# EAGLE board Module_BaseBoard (EAGLE 9.2.1), part 1 of 3
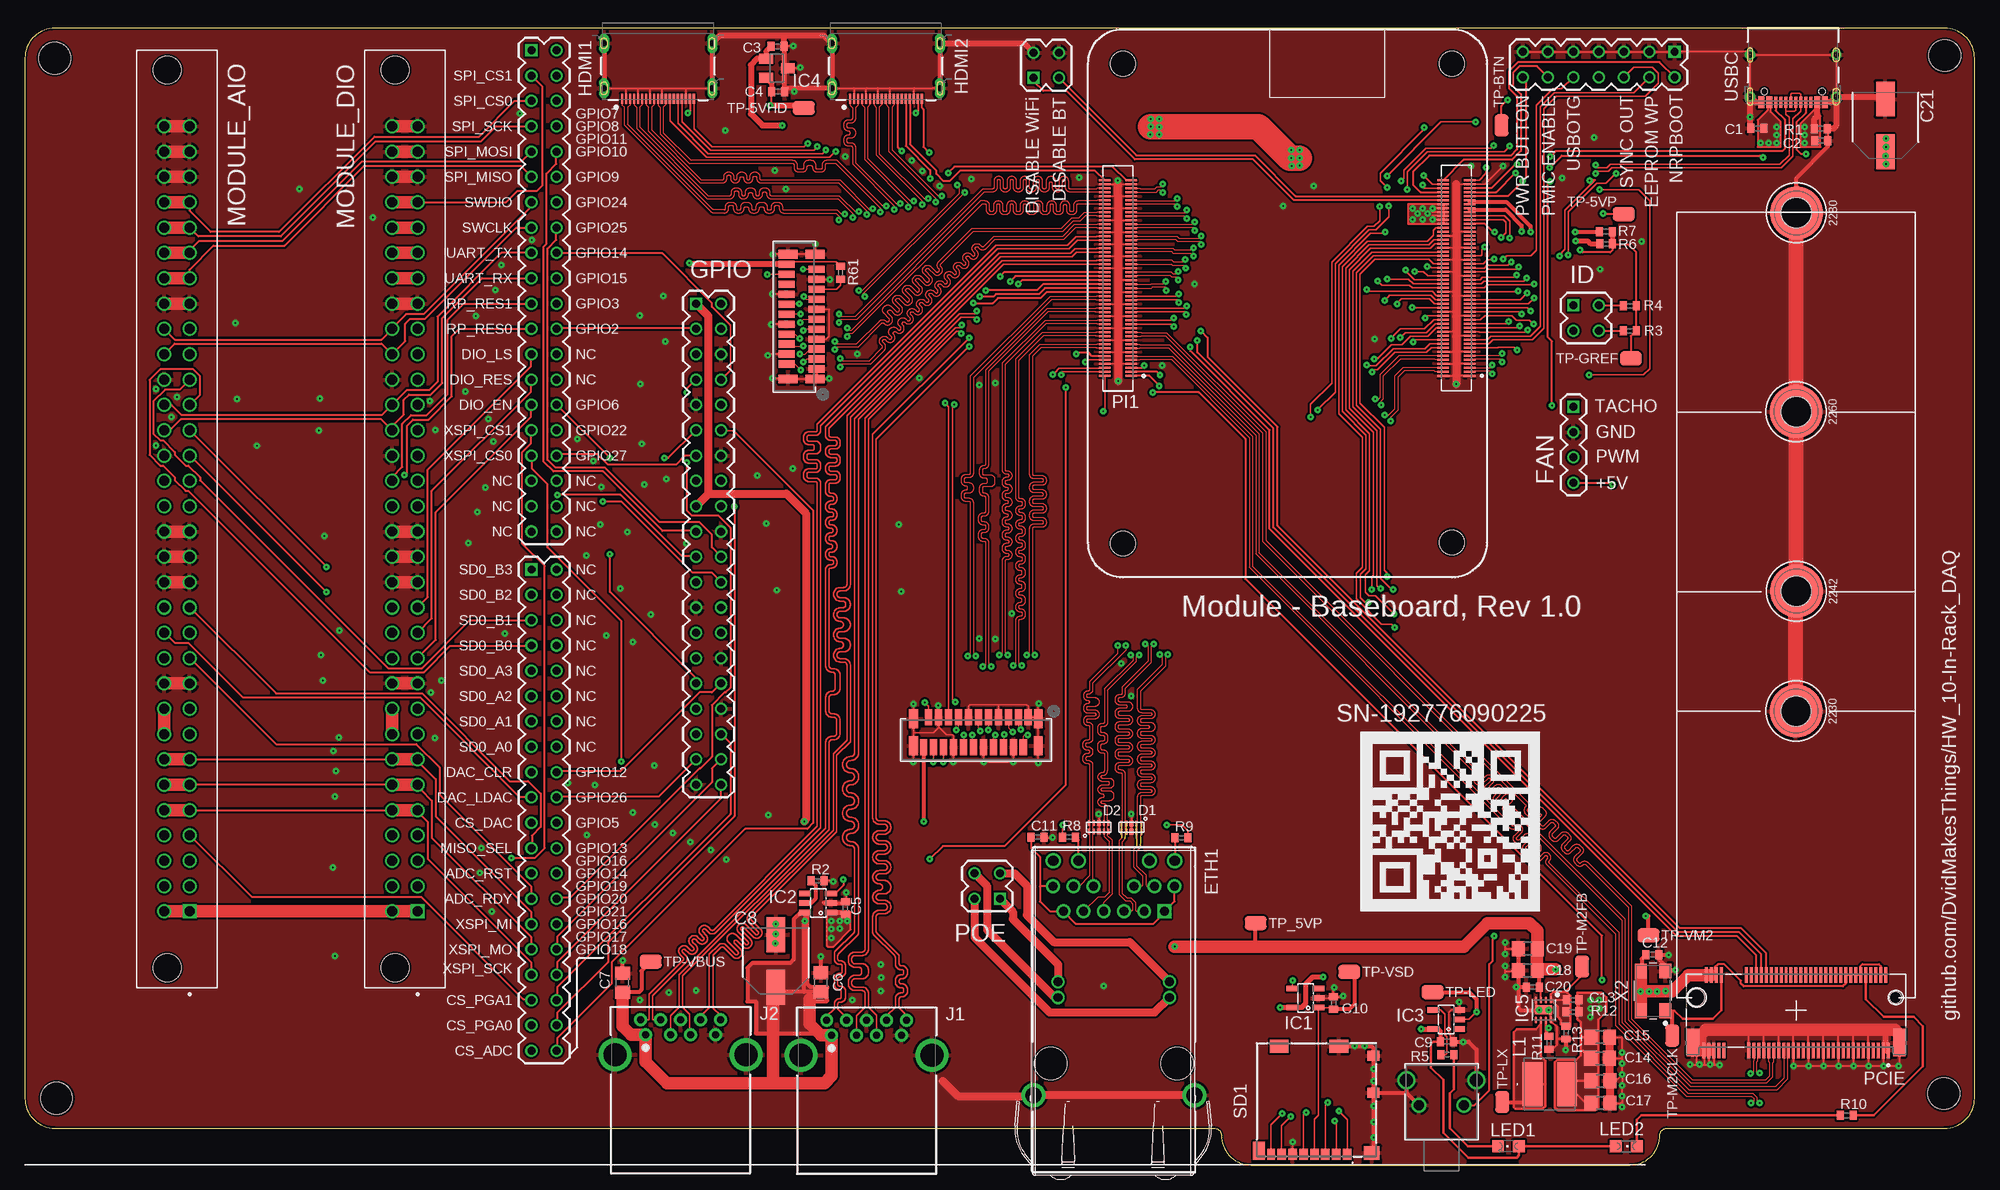
[diagram p5: board, top side]
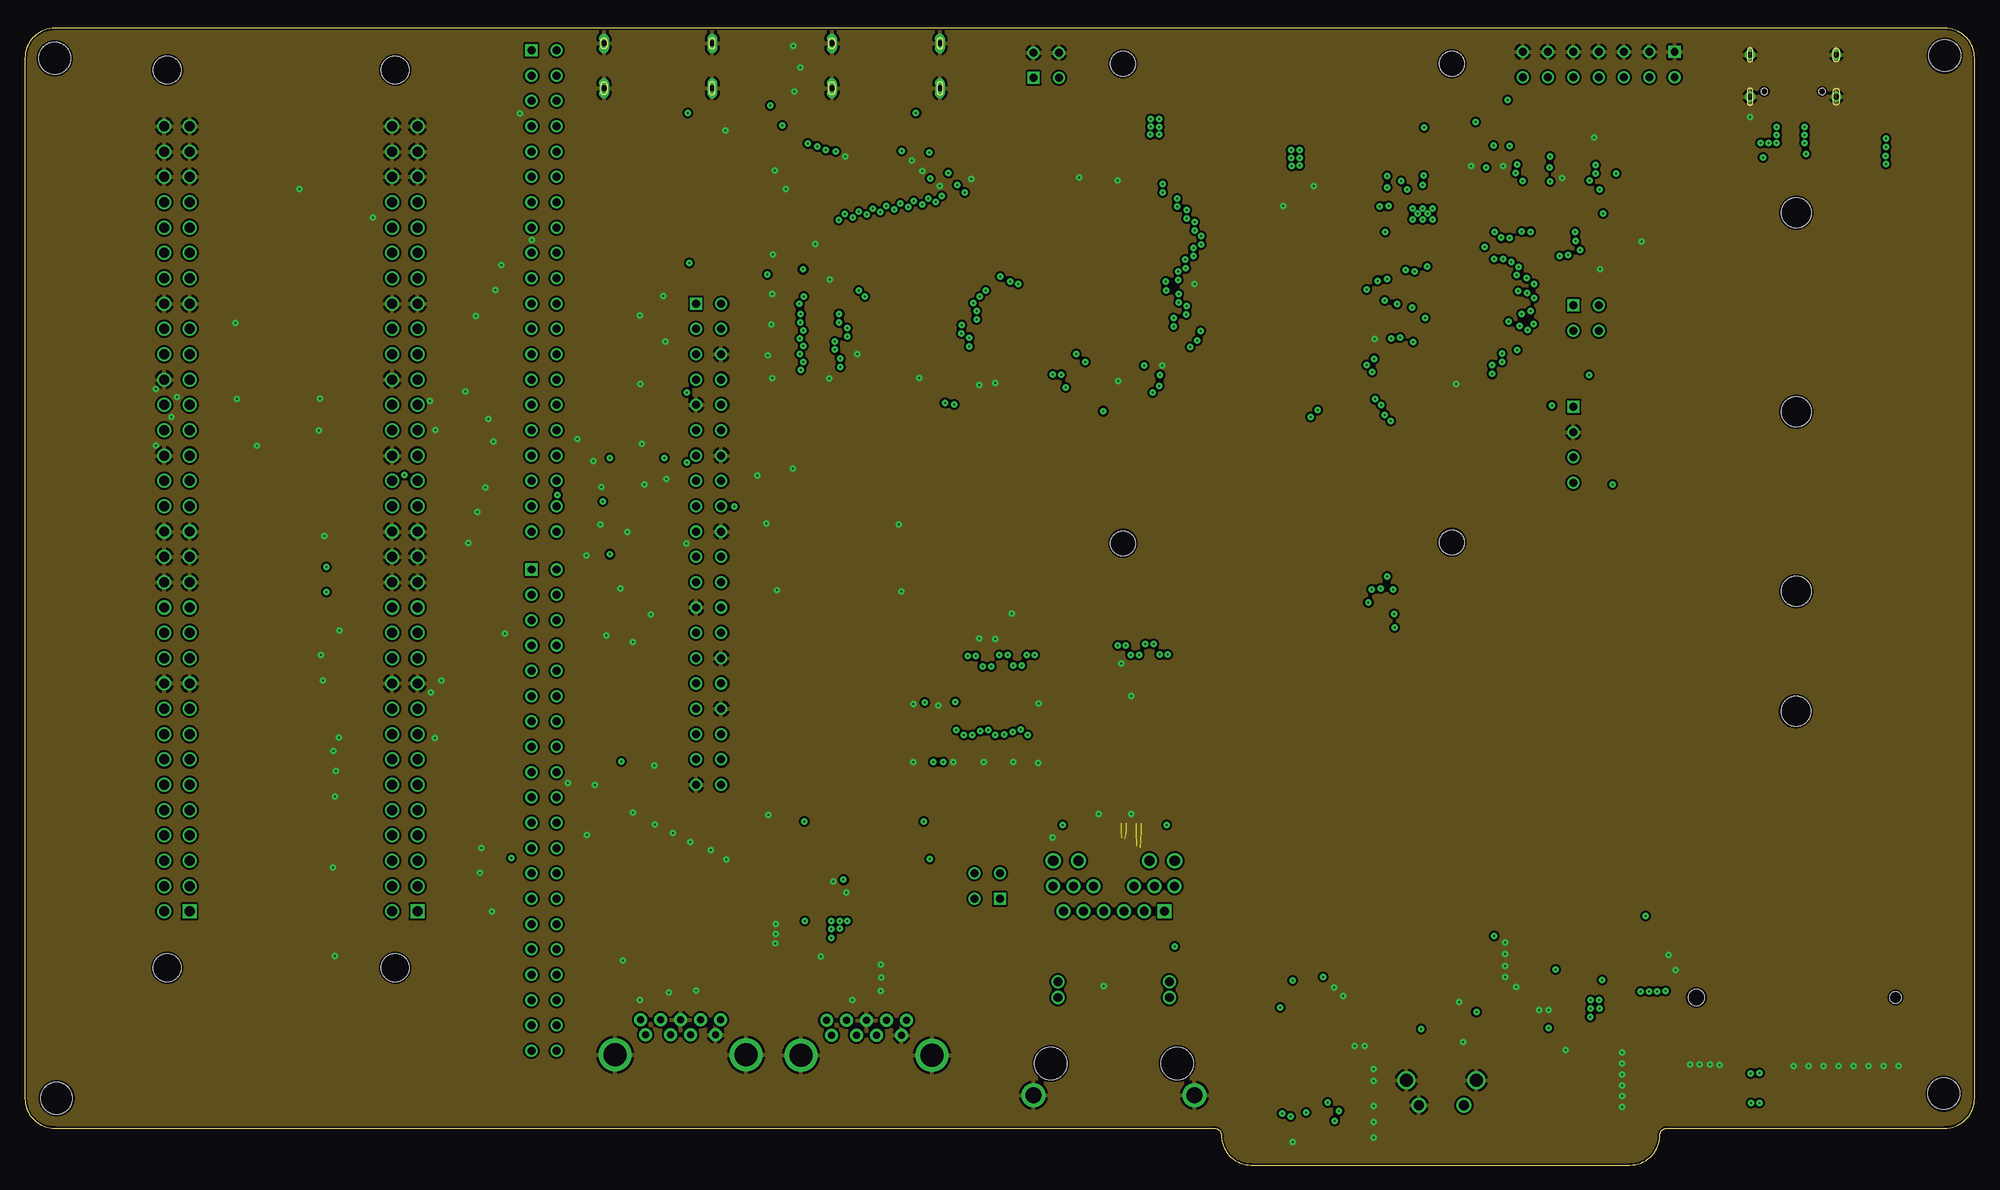
[diagram p6: board, inner layer Route2]
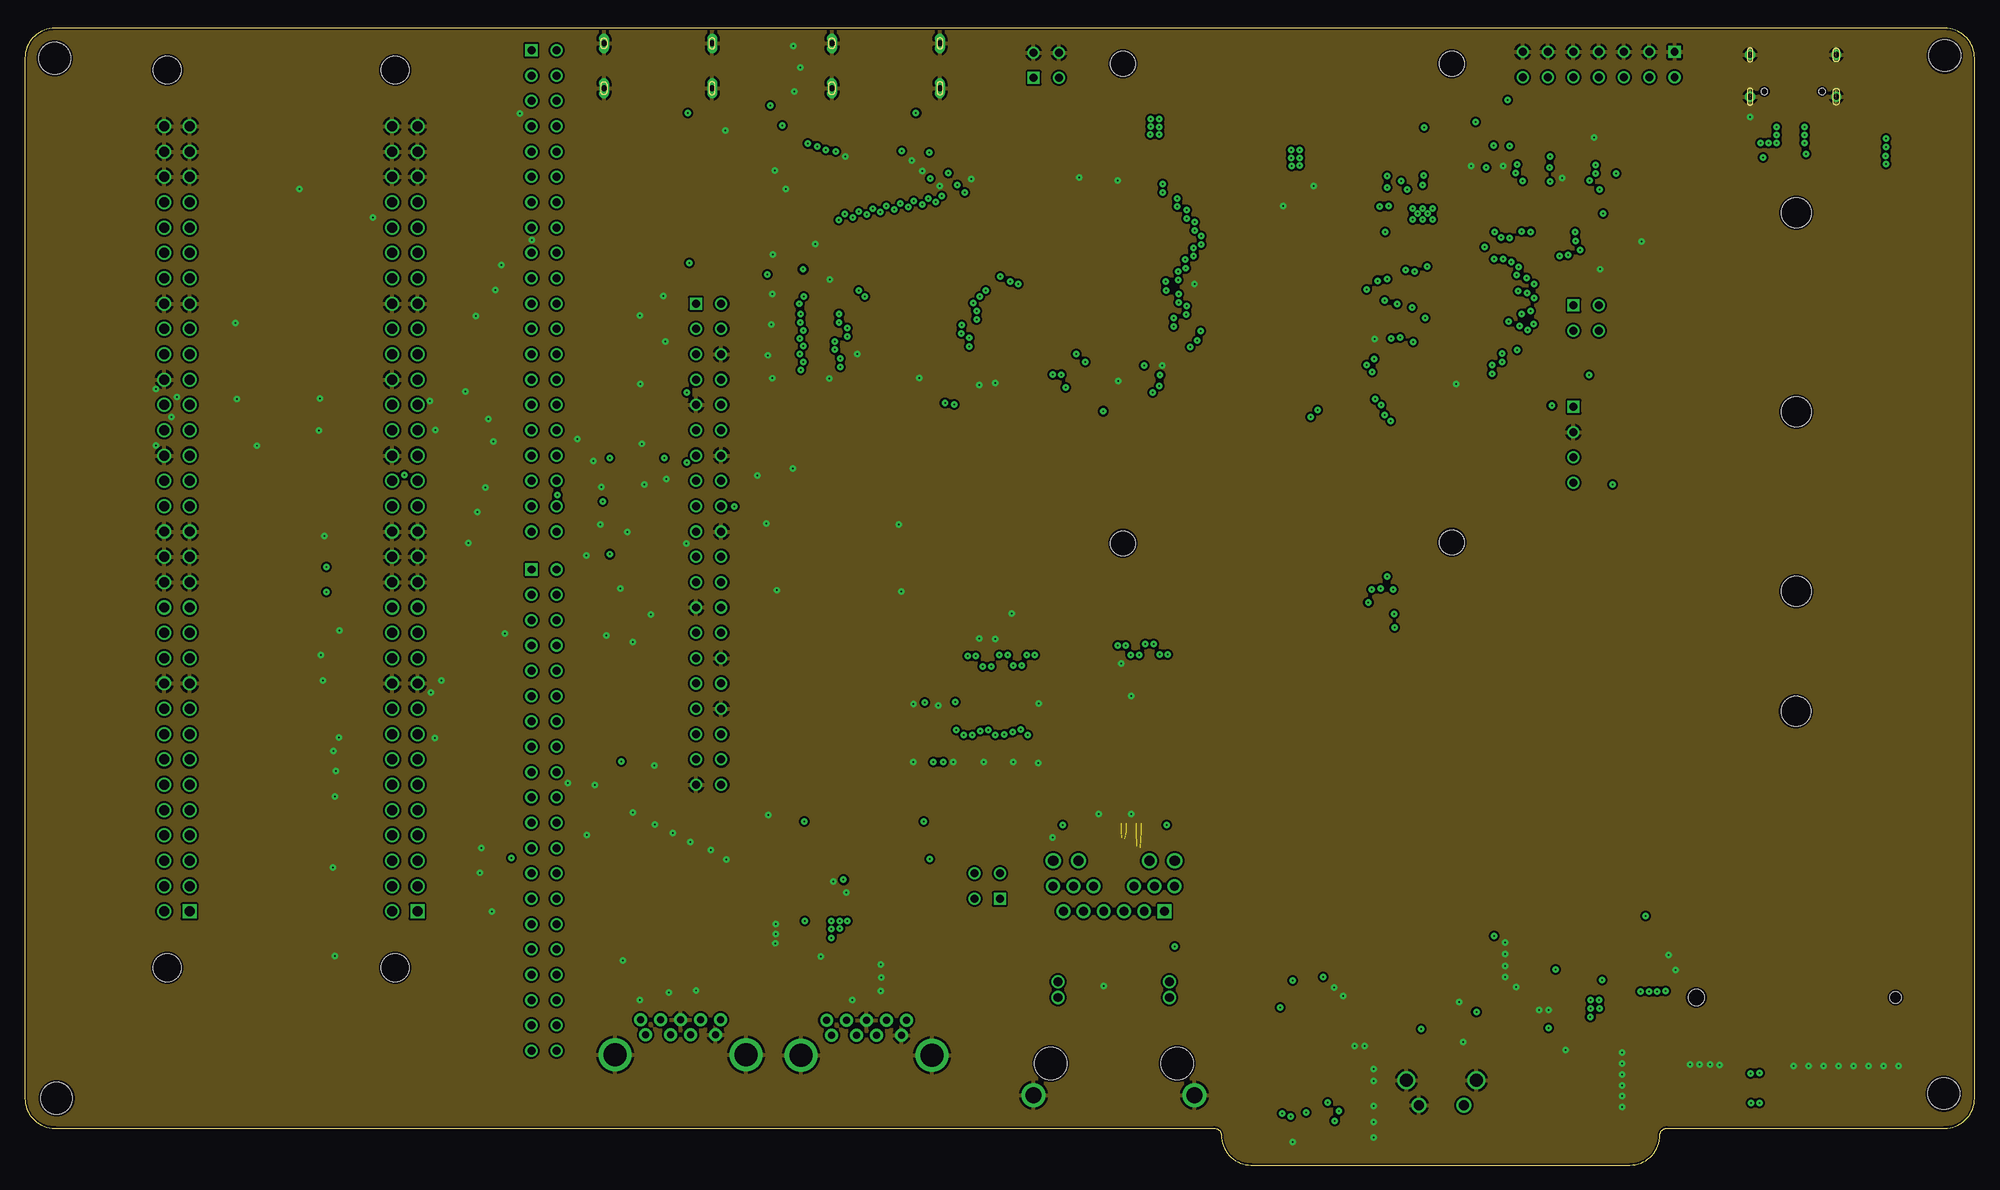
[diagram p7: board, inner layer Route15]
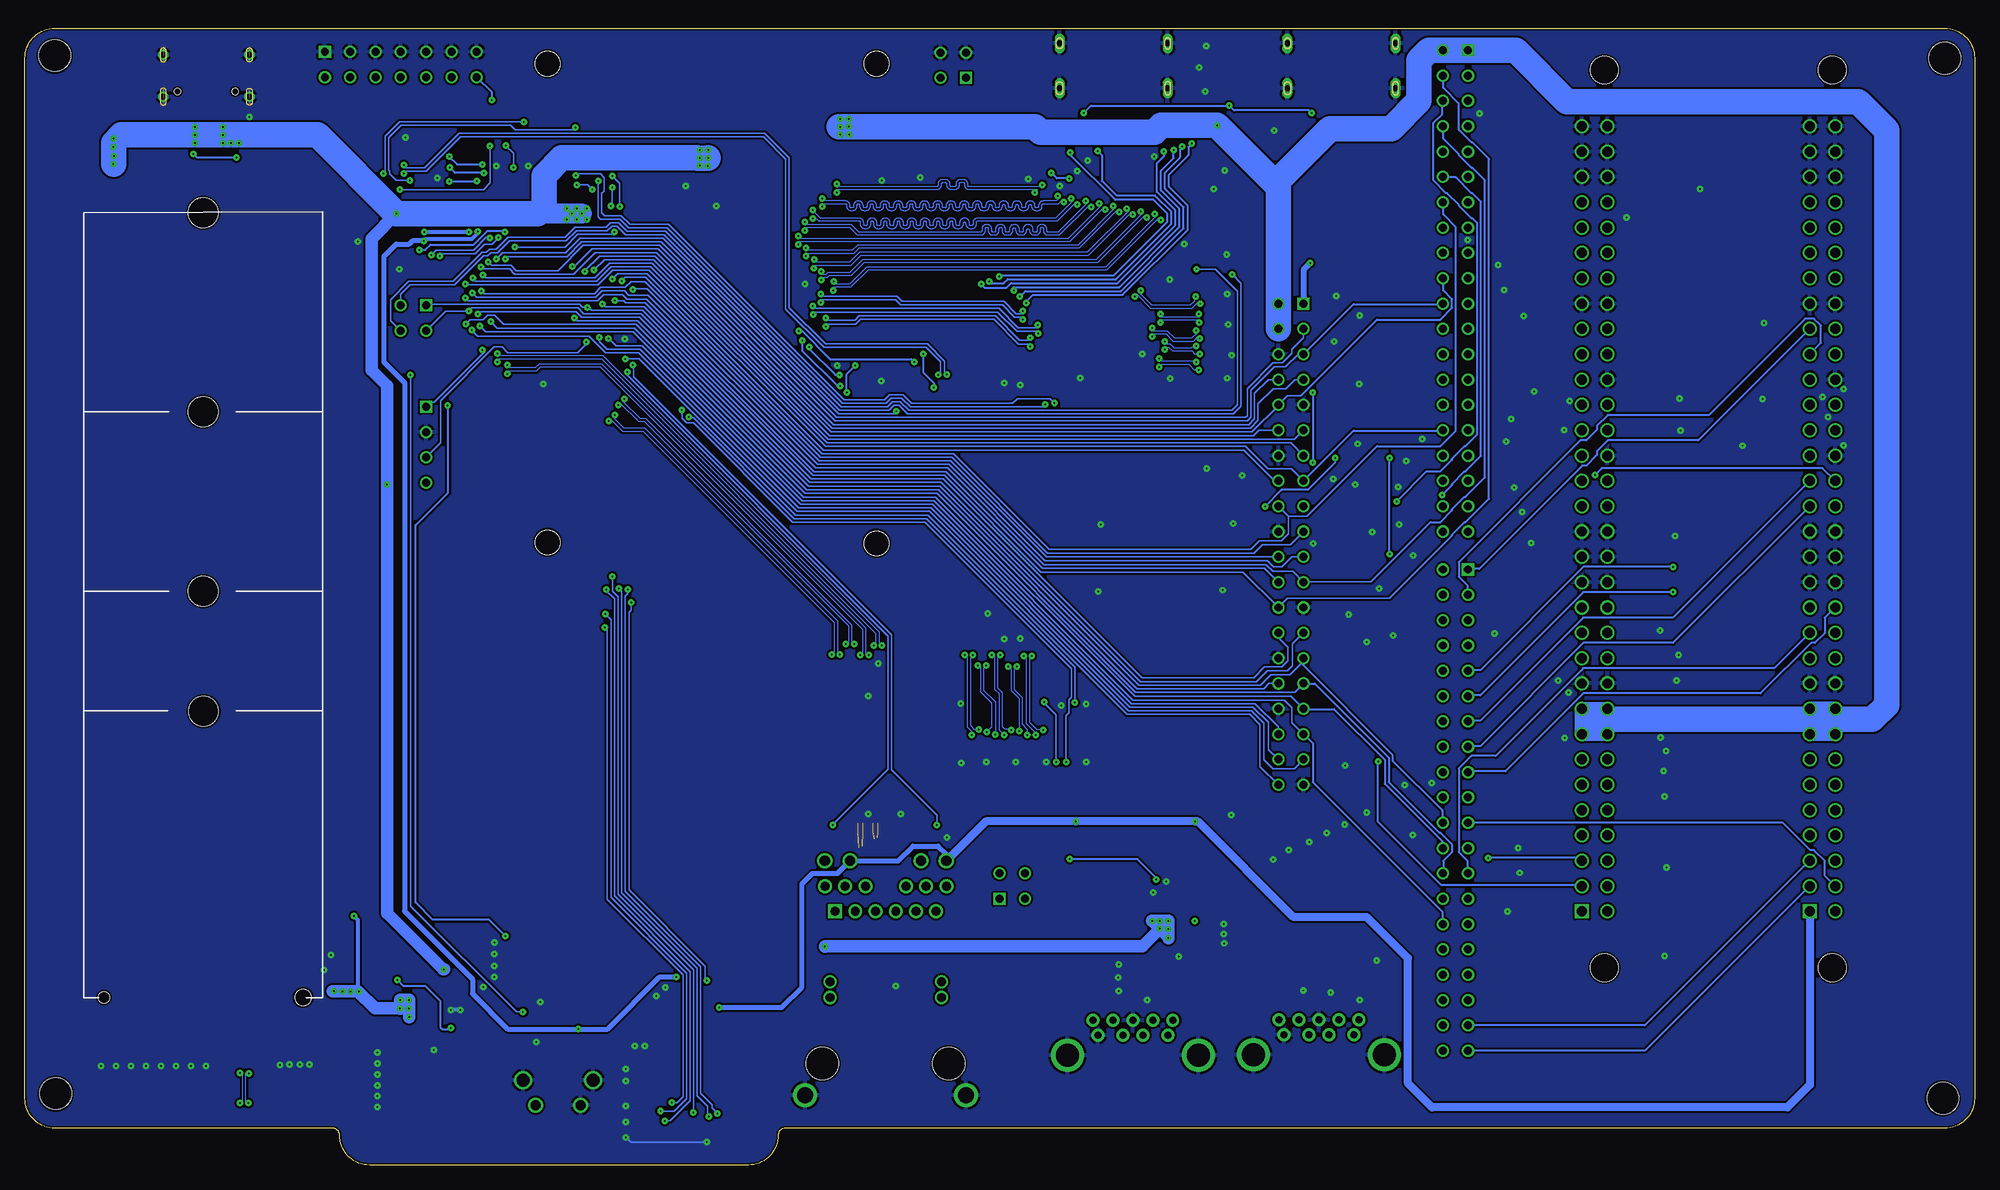
[diagram p8: board, bottom side, seen from below]

Size 195.56 x 114 mm. Coordinates in mm from the lower left corner, seen from the top.
Outline: 195.56,6.69 195.56,111 arc90 192.56,114 3,114 arc90 0,111 0,6.69 arc90 3,3.69 119.31,3.69 arc-90 120,3 arc90 123,0 161,0 arc90 164,3 arc-90 164.69,3.69 192.56,3.69 arc90 195.56,6.69
Copper layers (1+2*15+16): Top 0.035mm / dielectric 0.0994mm / Route2 0.0152mm / dielectric 1.265mm / Route15 0.0152mm / dielectric 0.0994mm / Bottom 0.035mm
Design rules "JLC04161H-3313 *": minimum track width 3.5mil, minimum drill 0.15mm, track to track 3.5mil, track to pad 3.5mil, pad to pad 3.5mil, via to via 3.5mil, smd to smd 3.5mil, copper to edge 0.2mm, drill to drill 6mil, minimum pad ring 8mil, minimum via ring 0.25mm, stop-mask expansion 0.05mm, vias tented up to drill 16mil, thermal gap 10mil
Net classes: 0 default: width 0.16 mm, drill 0.15 mm, clearance 0.191 mm; 1 50R_DIFFPAIR: width 0.4 mm, drill 0.15 mm, clearance 0.191 mm; 2 90R_DIFFPAIR: width 0.155 mm, drill 0.15 mm, clearance 0.191 mm; 3 100R_DIFFPAIR: width 0.121 mm, drill 0.15 mm, clearance 0.191 mm
Holes 3.2 mm at 3.17,6.71 3,111 192.58,111.26 192.47,7.17

## Footprints (pad centres in the part's own frame; a part is rotated, then mirrored left to right if it is on the bottom)
WA-SMSI_9774010243 = smd 5.3 x 5.3: 1 0,0 | hole 3: 0,0
C0402 = smd 0.7 x 0.9: 1 -0.65,0; 2 0.65,0
C0805 = smd 1.3 x 1.5: 1 -0.95,0; 2 0.95,0
100UF-16V = smd 3.5 x 1.85: 1 -2.65,0; 2 2.65,0
2X20 = drill 0.8 square: 1 -1.27,24.13 | drill 0.8: 2 1.27,24.13; 3 -1.27,21.59; 4 1.27,21.59; 5 -1.27,19.05; 6 1.27,19.05; 7 -1.27,16.51; 8 1.27,16.51; 9 -1.27,13.97; 10 1.27,13.97; 11 -1.27,11.43; 12 1.27,11.43; 13 -1.27,8.89; 14 1.27,8.89; 15 -1.27,6.35; 16 1.27,6.35; 17 -1.27,3.81; 18 1.27,3.81; 19 -1.27,1.27; 20 1.27,1.27; 21 -1.27,-1.27; 22 1.27,-1.27; 23 -1.27,-3.81; 24 1.27,-3.81; 25 -1.27,-6.35; 26 1.27,-6.35; 27 -1.27,-8.89; 28 1.27,-8.89; 29 -1.27,-11.43; 30 1.27,-11.43; 31 -1.27,-13.97; 32 1.27,-13.97; 33 -1.27,-16.51; 34 1.27,-16.51; 35 -1.27,-19.05; 36 1.27,-19.05; 37 -1.27,-21.59; 38 1.27,-21.59; 39 -1.27,-24.13; 40 1.27,-24.13
USON = smd 0.57 x 0.2: 1 -0.4,1; 2 -0.4,0.5; 4 -0.4,-0.5; 5 -0.4,-1; 6 0.435,-1; 7 0.435,-0.5; 9 0.435,0.5; 10 0.435,1 | smd 0.57 x 0.4: 3 -0.4,0; 8 0.435,0
MAGJACK_POE = drill 1.02 pad 1.53: 17 6.11,15.24; 18 3.57,15.24; 19 -3.54,15.24; 20 -6.08,15.24 | drill 0.9 pad 1.4: CT1 -6.08,12.7; CT2 -5.07,10.16; CT4 6.1,12.7; TD1+ -4.05,12.7; TD1- -2.02,12.7; TD2+ -1.01,10.16; TD2- -3.04,10.16; TD3+ 1.02,10.16; TD3- 3.05,10.16; TD4+ 4.07,12.7; TD4- 2.04,12.7 | drill 0.9 pad 1.4 square: CT3 5.08,10.16 | drill 1.6 pad 2.4: MH3 -8.06,-8.25; MH4 8.08,-8.25 | drill 0.9 pad 1.25: VC1 5.6,3.1; VC2 -5.58,3.1; VC3 5.6,1.53; VC4 -5.58,1.53 | hole 3.25: -6.34,-5.08; 6.36,-5.08
1X4 = drill 0.8 square: 1 0,3.81 | drill 0.8: 2 0,1.27; 3 0,-1.27; 4 0,-3.81
685119136923 = smd 0.23 x 1: 1 3.6,1.05; 2 3.2,1.05; 3 2.8,1.05; 4 2.4,1.05; 5 2,1.05; 6 1.6,1.05; 7 1.2,1.05; 8 0.8,1.05; 9 0.4,1.05; 10 0,1.05; 11 -0.4,1.05; 12 -0.8,1.05; 13 -1.2,1.05; 14 -1.6,1.05; 15 -2,1.05; 16 -2.4,1.05; 17 -2.8,1.05; 18 -3.2,1.05; 19 -3.6,1.05 | drill 0.6 pad 0.9 long: S1 5.425,0; S2 -5.425,0 | drill 0.6 pad 0.8 long: S3 -5.425,-4.5; S4 5.425,-4.5
SOT23-5 = smd 0.55 x 1.2: 1 -0.95,-1.3; 2 0,-1.3; 3 0.95,-1.3; 4 0.95,1.3; 5 -0.95,1.3
SOT23-6 = smd 0.55 x 1.2: 1 -0.95,-1.3; 2 0,-1.3; 3 0.95,-1.3; 4 0.95,1.3; 5 0,1.3; 6 -0.95,1.3
SOT23 = smd 1 x 1.4: 1 -0.95,-1.1; 2 0.95,-1.1; 3 0,1.1
SON50P201X201X56-9T90X170N = smd 0.715 x 0.27: 1 -1.001,0.75; 2 -1.001,0.25; 3 -1.001,-0.25; 4 -1.001,-0.75; 5 1.001,-0.75; 6 1.001,-0.25; 7 1.001,0.25; 8 1.001,0.75 | smd 0.9 x 1.7: 9 0,0
2X2 = drill 0.8 square: 1 -1.27,1.27 | drill 0.8: 2 1.27,1.27; 3 -1.27,-1.27; 4 1.27,-1.27
692121030100 = drill 0.7 pad 1.3: 1 -3.5,5.36; 2 -1,5.36; 3 1,5.36; 4 3.5,5.36; 5 4,6.86; 6 2,6.86; 7 0,6.86; 8 -2,6.86; 9 -4,6.86 | drill 2.3 pad 3.3: S1 -6.57,3.36; S2 6.57,3.36
FH12-22S-0.5SH = smd 0.711 x 1.6: 1 5.251,2.244; 2 4.751,-0.756; 3 4.251,2.244; 4 3.751,-0.756; 5 3.251,2.244; 6 2.751,-0.756; 7 2.251,2.244; 8 1.75,-0.756; 9 1.25,2.244; 10 0.75,-0.756; 11 0.25,2.244; 12 -0.25,-0.756; 13 -0.75,2.244; 14 -1.25,-0.756; 15 -1.75,2.244; 16 -2.251,-0.756; 17 -2.751,2.244; 18 -3.251,-0.756; 19 -3.751,2.244; 20 -4.251,-0.756; 21 -4.751,2.244; 22 -5.251,-0.756 | smd 0.889 x 1.905: 23 -6.25,2.091; 24 6.25,2.091; 25 -6.25,-0.604; 26 6.25,-0.604
2X7 = drill 0.8 square: 1 -1.27,7.62 | drill 0.8: 2 1.27,7.62; 3 -1.27,5.08; 4 1.27,5.08; 5 -1.27,2.54; 6 1.27,2.54; 7 -1.27,0; 8 1.27,0; 9 -1.27,-2.54; 10 1.27,-2.54; 11 -1.27,-5.08; 12 1.27,-5.08; 13 -1.27,-7.62; 14 1.27,-7.62
SRR5228A = smd 4.4 x 2: 1 0,1.75; 2 0,-1.75
CHIPLED_0805 = smd 1.2 x 1.2: A 0,-1.05; C 0,1.05
CON-VG-MAB64-RECEPTACLE = drill 1 pad 1.35 square: A1 39.37,1.27 | drill 1 pad 1.35: A2 36.83,1.27; A3 34.29,1.27; A4 31.75,1.27; A5 29.21,1.27; A6 26.67,1.27; A7 24.13,1.27; A8 21.59,1.27; A9 19.05,1.27; A10 16.51,1.27; A11 13.97,1.27; A12 11.43,1.27; A13 8.89,1.27; A14 6.35,1.27; A15 3.81,1.27; A16 1.27,1.27; A17 -1.27,1.27; A18 -3.81,1.27; A19 -6.35,1.27; A20 -8.89,1.27; A21 -11.43,1.27; A22 -13.97,1.27; A23 -16.51,1.27; A24 -19.05,1.27; A25 -21.59,1.27; A26 -24.13,1.27; A27 -26.67,1.27; A28 -29.21,1.27; A29 -31.75,1.27; A30 -34.29,1.27; A31 -36.83,1.27; A32 -39.37,1.27; B1 39.37,-1.27; B2 36.83,-1.27; B3 34.29,-1.27; B4 31.75,-1.27; B5 29.21,-1.27; B6 26.67,-1.27; B7 24.13,-1.27; B8 21.59,-1.27; B9 19.05,-1.27; B10 16.51,-1.27; B11 13.97,-1.27; B12 11.43,-1.27; B13 8.89,-1.27; B14 6.35,-1.27; B15 3.81,-1.27; B16 1.27,-1.27; B17 -1.27,-1.27; B18 -3.81,-1.27; B19 -6.35,-1.27; B20 -8.89,-1.27; B21 -11.43,-1.27; B22 -13.97,-1.27; B23 -16.51,-1.27; B24 -19.05,-1.27; B25 -21.59,-1.27; B26 -24.13,-1.27; B27 -26.67,-1.27; B28 -29.21,-1.27; B29 -31.75,-1.27; B30 -34.29,-1.27; B31 -36.83,-1.27; B32 -39.37,-1.27 | hole 2.79: -45.01,-0.97; 45.01,-0.97
M.2 = smd 0.3 x 1.55: 1 9.25,-4.005; 2 9,3.545; 3 8.75,-4.005; 4 8.5,3.545; 5 8.25,-4.005; 6 8,3.545; 7 7.75,-4.005; 8 7.5,3.545; 9 7.25,-4.005; 10 7,3.545; 11 6.75,-4.005; 12 6.5,3.545; 13 6.25,-4.005; 14 6,3.545; 15 5.75,-4.005; 16 5.5,3.545; 17 5.25,-4.005; 18 5,3.545; 19 4.75,-4.005; 20 4.5,3.545; 21 4.25,-4.005; 22 4,3.545; 23 3.75,-4.005; 24 3.5,3.545; 25 3.25,-4.005; 26 3,3.545; 27 2.75,-4.005; 28 2.5,3.545; 29 2.25,-4.005; 30 2,3.545; 31 1.75,-4.005; 32 1.5,3.545; 33 1.25,-4.005; 34 1,3.545; 35 0.75,-4.005; 36 0.5,3.545; 37 0.25,-4.005; 38 0,3.545; 39 -0.25,-4.005; 40 -0.5,3.545; 41 -0.75,-4.005; 42 -1,3.545; 43 -1.25,-4.005; 44 -1.5,3.545; 45 -1.75,-4.005; 46 -2,3.545; 47 -2.25,-4.005; 48 -2.5,3.545; 49 -2.75,-4.005; 50 -3,3.545; 51 -3.25,-4.005; 52 -3.5,3.545; 53 -3.75,-4.005; 54 -4,3.545; 55 -4.25,-4.005; 56 -4.5,3.545; 57 -4.75,-4.005; 58 -5,3.545; 67 -7.25,-4.005; 68 -7.5,3.545; 69 -7.75,-4.005; 70 -8,3.545; 71 -8.25,-4.005; 72 -8.5,3.545; 73 -8.75,-4.005; 74 -9,3.545; 75 -9.25,-4.005 | smd 1.2 x 2.75: S1 10.35,-3.23; S2 -10.35,-3.23 | hole 1.15: 10,1.27 | hole 1.65: -10,1.27
CM5 = smd 1.14 x 0.2: 1 17.9,-7.22; 2 15.26,-7.22; 3 17.9,-6.82; 4 15.26,-6.82; 5 17.9,-6.42; 6 15.26,-6.42; 7 17.9,-6.02; 8 15.26,-6.02; 9 17.9,-5.62; 10 15.26,-5.62; 11 17.9,-5.22; 12 15.26,-5.22; 13 17.9,-4.82; 14 15.26,-4.82; 15 17.9,-4.42; 16 15.26,-4.42; 17 17.9,-4.02; 18 15.26,-4.02; 19 17.9,-3.62; 20 15.26,-3.62; 21 17.9,-3.22; 22 15.26,-3.22; 23 17.9,-2.82; 24 15.26,-2.82; 25 17.9,-2.42; 26 15.26,-2.42; 27 17.9,-2.02; 28 15.26,-2.02; 29 17.9,-1.62; 30 15.26,-1.62; 31 17.9,-1.22; 32 15.26,-1.22; 33 17.9,-0.82; 34 15.26,-0.82; 35 17.9,-0.42; 36 15.26,-0.42; 37 17.9,-0.02; 38 15.26,-0.02; 39 17.9,0.38; 40 15.26,0.38; 41 17.9,0.78; 42 15.26,0.78; 43 17.9,1.18; 44 15.26,1.18; 45 17.9,1.58; 46 15.26,1.58; 47 17.9,1.98; 48 15.26,1.98; 49 17.9,2.38; 50 15.26,2.38; 51 17.9,2.78; 52 15.26,2.78; 53 17.9,3.18; 54 15.26,3.18; 55 17.9,3.58; 56 15.26,3.58; 57 17.9,3.98; 58 15.26,3.98; 59 17.9,4.38; 60 15.26,4.38; 61 17.9,4.78; 62 15.26,4.78; 63 17.9,5.18; 64 15.26,5.18; 65 17.9,5.58; 66 15.26,5.58; 67 17.9,5.98; 68 15.26,5.98; 69 17.9,6.38; 70 15.26,6.38; 71 17.9,6.78; 72 15.26,6.78; 73 17.9,7.18; 74 15.26,7.18; 75 17.9,7.58; 76 15.26,7.58; 77 17.9,7.98; 78 15.26,7.98; 79 17.9,8.38; 80 15.26,8.38; 81 17.9,8.78; 82 15.26,8.78; 83 17.9,9.18; 84 15.26,9.18; 85 17.9,9.58; 86 15.26,9.58; 87 17.9,9.98; 88 15.26,9.98; 89 17.9,10.38; 90 15.26,10.38; 91 17.9,10.78; 92 15.26,10.78; 93 17.9,11.18; 94 15.26,11.18; 95 17.9,11.58; 96 15.26,11.58; 97 17.9,11.98; 98 15.26,11.98; 99 17.9,12.38; 100 15.26,12.38; 101 -16.041,-7.26; 102 -18.681,-7.26; 103 -16.041,-6.86; 104 -18.681,-6.86; 105 -16.041,-6.46; 106 -18.681,-6.46; 107 -16.041,-6.06; 108 -18.681,-6.06; 109 -16.041,-5.66; 110 -18.681,-5.66; 111 -16.041,-5.26; 112 -18.681,-5.26; 113 -16.041,-4.86; 114 -18.681,-4.86; 115 -16.041,-4.46; 116 -18.681,-4.46; 117 -16.041,-4.06; 118 -18.681,-4.06; 119 -16.041,-3.66; 120 -18.681,-3.66; 121 -16.041,-3.26; 122 -18.681,-3.26; 123 -16.041,-2.86; 124 -18.681,-2.86; 125 -16.041,-2.46; 126 -18.681,-2.46; 127 -16.041,-2.06; 128 -18.681,-2.06; 129 -16.041,-1.66; 130 -18.681,-1.66; 131 -16.041,-1.26; 132 -18.681,-1.26; 133 -16.041,-0.86; 134 -18.681,-0.86; 135 -16.041,-0.46; 136 -18.681,-0.46; 137 -16.041,-0.06; 138 -18.681,-0.06; 139 -16.041,0.34; 140 -18.681,0.34; 141 -16.041,0.74; 142 -18.681,0.74; 143 -16.041,1.14; 144 -18.681,1.14; 145 -16.041,1.54; 146 -18.681,1.54; 147 -16.041,1.94; 148 -18.681,1.94; 149 -16.041,2.34; 150 -18.681,2.34; 151 -16.041,2.74; 152 -18.681,2.74; 153 -16.041,3.14; 154 -18.681,3.14; 155 -16.041,3.54; 156 -18.681,3.54; 157 -16.041,3.94; 158 -18.681,3.94; 159 -16.041,4.34; 160 -18.681,4.34; 161 -16.041,4.74; 162 -18.681,4.74; 163 -16.041,5.14; 164 -18.681,5.14; 165 -16.041,5.54; 166 -18.681,5.54; 167 -16.041,5.94; 168 -18.681,5.94; 169 -16.041,6.34; 170 -18.681,6.34; 171 -16.041,6.74; 172 -18.681,6.74; 173 -16.041,7.14; 174 -18.681,7.14; 175 -16.041,7.54; 176 -18.681,7.54; 177 -16.041,7.94; 178 -18.681,7.94; 179 -16.041,8.34; 180 -18.681,8.34; 181 -16.041,8.74; 182 -18.681,8.74; 183 -16.041,9.14; 184 -18.681,9.14; 185 -16.041,9.54; 186 -18.681,9.54; 187 -16.041,9.94; 188 -18.681,9.94; 189 -16.041,10.34; 190 -18.681,10.34; 191 -16.041,10.74; 192 -18.681,10.74; 193 -16.041,11.14; 194 -18.681,11.14; 195 -16.041,11.54; 196 -18.681,11.54; 197 -16.041,11.94; 198 -18.681,11.94; 199 -16.041,12.34; 200 -18.681,12.34 | hole 2.5: -16.86,24.04; 16.14,24.04; -16.86,-24.06; 16.14,-23.96
0402 = smd 0.7 x 0.9: 1 -0.65,0; 2 0.65,0
MICROSD = smd 0.85 x 1.1: CLK -1.295,-5.294; CMD 0.905,-5.294; DAT0 -3.495,-5.294; DAT2 3.105,-5.294; DAT3/CD 2.005,-5.294; VDD -0.195,-5.294; VSS -2.395,-5.294 | smd 0.75 x 1.1: DAT1 -4.545,-5.294 | smd 1.17 x 1.8: DET1 -5.755,-4.944 | smd 1.9 x 1.35: DET2 -3.73,5.531; MT1 2.24,5.531 | smd 1.2 x 1: MT2 5.74,4.556; MT3 5.74,0.856 | smd 1.55 x 1.35: MT4 5.565,-5.169
SW2_1825027-C_TEC = drill 0.991 pad 1.499: 1 0,0; 2 4.496,0 | drill 1.295 pad 1.803: 3 -1.245,2.489; 4 5.766,2.489
TP = smd 2.2 x 1.4: TP 0,0
629722000214 = smd 0.3 x 1.15: A1 -3.35,4.745; A4 -2.55,4.745; A5 -1.25,4.745; A6 -0.25,4.745; A7 0.25,4.745; A8 1.25,4.745; A9 2.55,4.745; A12 3.35,4.745; B1 3.05,4.745; B4 2.25,4.745; B5 1.75,4.745; B6 0.75,4.745; B7 -0.75,4.745; B8 -1.75,4.745; B9 -2.25,4.745; B12 -3.05,4.745 | drill 0.6 pad 1: S1 -4.32,4.18; S2 4.32,4.18; S3 -4.32,0; S4 4.32,0 | hole 0.65: -2.89,3.68; 2.89,3.68
OSCCC500X320X130 = smd 1.487 x 1.187: 1 -1.988,-1.238; 2 1.988,-1.238; 3 1.988,1.238; 4 -1.988,1.238

## Placement (x,y rotation side)
2230  M2 x 1mm  [WA-SMSI_9774010243]  177.65,45.52 270 top
2242  M2 x 1mm  [WA-SMSI_9774010243]  177.69,57.56 270 top
2260  M2 x 1mm  [WA-SMSI_9774010243]  177.66,75.55 270 top
2280  M2 x 1mm  [WA-SMSI_9774010243]  177.69,95.48 270 top
C1  [C0402]  173.78,103.96 180 top
C2  [C0402]  180.17,102.73 0 top
C3  100nF  [C0402]  75.48,112.18 0 top
C4  100nF  [C0402]  75.55,107.65 0 top
C5  100nF  [C0402]  82.31,25.75 90 top
C6  10uF  [C0805]  79.83,18.32 90 top
C7  10uF  [C0805]  59.94,18.3 90 top
C8  100uF 16V  [100UF-16V]  75.33,20.46 90 top
C9  100nF  [C0402]  142.63,12.37 0 top
C10  100nF  [C0402]  131.27,16.25 90 top
C11  100nF  [C0402]  101.57,32.89 0 top
C12  100nF  [C0402]  163.24,21.09 0 top
C13  4.7nF  [C0402]  155.24,16.57 180 top
C14  10uF  [C0805]  157.99,10.69 0 top
C15  10uF  [C0805]  158,12.83 0 top
C16  10uF  [C0805]  158.01,8.44 0 top
C17  10uF  [C0805]  158.02,6.22 0 top
C18  10uF  [C0805]  150.73,19.51 180 top
C19  10uF  [C0805]  150.74,21.7 180 top
C20  100nF  [C0402]  151.24,17.85 180 top
C21  100uF 16V  [100UF-16V]  186.62,104.25 90 top
CON2  [2X20]  52.07,35.59 0 top
CON3  [2X20]  52.07,87.66 0 top
D1  TPD4EUSB30  [USON]  110.99,33.86 270 top
D2  TPD4EUSB30  [USON]  107.71,33.86 90 top
ETH1  G16LX-188S7-1G-GO-Y  [MAGJACK_POE]  109.22,15.27 0 top
FAN  [1X4]  155.33,72.23 0 top
GPIO  [2X20]  68.58,62.26 0 top
HDMI1  685119136923  [685119136923]  63.5,107.98 180 top
HDMI2  685119136923  [685119136923]  86.36,107.98 180 top
IC1  RT9742GGJ  [SOT23-5]  128.46,16.74 90 top
IC2  AP22653W6  [SOT23-6]  79.57,26.27 90 top
IC3  74LVC1G07  [SOT23-5]  142.56,14.61 90 top
IC4  RT9742NGV  [SOT23]  75.42,109.99 270 top
IC5  AP3441SHE-7B  [SON50P201X201X56-9T90X170N]  152.33,15.55 270 top
ID  [2X2]  156.6,84.93 0 top
J1  692121030100  [692121030100]  84.43,7.64 0 top
J2  692121030100  [692121030100]  65.77,7.7 0 top
J3  FH12-22S-0.5SVA  [FH12-22S-0.5SH]  95.39,42.64 0 top
J4  FH12-22S-0.5SVA  [FH12-22S-0.5SH]  77.17,85.08 270 top
JP2  [2X7]  157.85,110.36 270 top
JP3  [2X2]  102.44,110.29 90 top
L1  L  [SRR5228A]  152.94,8.12 90 top
LED1  Green  [CHIPLED_0805]  148.82,1.89 90 top
LED2  [CHIPLED_0805]  160.62,1.88 270 top
MODULE_AIO  CON-VG_MAB642  [CON-VG-MAB64-RECEPTACLE]  15.24,64.8 270 top
MODULE_DIO  CON-VG_MAB642  [CON-VG-MAB64-RECEPTACLE]  38.1,64.8 270 top
PCIE  M.2  [M.2]  177.65,15.51 0 top
PI1  [CM5]  127,86.39 0 top
POE  POE  [2X2]  96.52,27.97 180 top
R1  2.2K 1%  [0402]  180.15,103.94 0 top
R2  15K 1%  [0402]  79.52,28.51 0 top
R3  2.2K 1%  [0402]  160.96,83.65 180 top
R4  2.2K 1%  [0402]  160.97,86.15 180 top
R5  1K  [0402]  142.66,11.07 180 top
R6  0R  [0402]  158.6,92.37 0 top
R7  DNI  [0402]  158.59,93.61 0 top
R8  470R  [0402]  104.71,32.89 0 top
R9  470R  [0402]  115.99,32.82 0 top
R10  [0402]  182.73,4.97 0 top
R11  100K 1%  [0402]  152.86,12.28 270 top
R12  10K 1%  [0402]  155.23,15.36 180 top
R13  2.2K 1%  [0402]  154.57,13.29 270 top
R61  2.2K 1%  [0402]  81.81,89.46 90 top
SD1  [MICROSD]  129.54,6.38 0 top
SW1  1825027-8  [SW2_1825027-C_TEC]  139.83,6.01 0 top
TP-5VHD  TP  [TP]  78.12,106 180 top
TP-5VP  TP  [TP]  160.37,95.35 0 top
TP-BTN  TP  [TP]  148.1,104.25 90 top
TP-GREF  TP  [TP]  161.08,80.9 180 top
TP-LED  TP  [TP]  141.18,17.35 0 top
TP-LX  TP  [TP]  148.19,6.32 90 top
TP-M2CLK  TP  [TP]  165.24,12.98 270 top
TP-M2FB  TP  [TP]  156.17,19.91 90 top
TP-VBUS  TP  [TP]  62.76,20.39 0 top
TP-VM2  TP  [TP]  162.84,23.04 0 top
TP-VSD  TP  [TP]  132.83,19.37 0 top
TP_5VP  TP  [TP]  123.45,24.25 0 top
USBC  629722000214  [629722000214]  177.36,111.32 180 top
X2  CRYSTAL  [OSCCC500X320X130]  163.32,17.47 90 top

## Tracks (layer width: path | path; a pad name or v marks a point on that pad's centre or on a via)
!ADC_RST
  Bottom 0.2: CON2.25 50.86,29.33 50.86,30.5 51.74,31.38 51.74,39.77 50.47,41.04 48.03,41.04 39.24,49.83 20.11,49.83 16.6,53.34 MODULE_AIO.A12
+1V8  (via drill 0.15)
  Top 0.16: v155.47,93.58 155.5,93.6
  Top 0.2: PI1.87 144.9,96.59 PI1.89
  Top 0.406: 144.9,96.59 148.59,96.59 151.02,94.16 v151.02,93.59 | R7.1 155.5,93.6
  Bottom 0.406: v155.47,93.58 151.03,93.58 v151.02,93.59
+3V3  (via drill 0.15)
  Top 0.16: J4.22 76.65,90.57 81.35,90.57 R61.2
  Top 0.2: PI1.83 144.9,95.8 PI1.85
  Top 0.254: LED2.A LED1.A 149.87,0.99 149.63,0.75 144.78,0.75 142.27,3.26 142.27,8.55 141.04,9.78 141.04,12.12 141.29,12.37 C9.1
  Top 0.406: IC3.5 141.77,13.66 141.98,13.45 C9.1 | 144.9,95.8 148.54,95.8 150.12,94.22 v150.12,93.6 | J3.22 90.14,34.49 v90.16,34.47
  Top 0.508: v155.53,92.68 156.75,92.68 157.09,92.34 157.92,92.34 R6.1 | v140.04,13.64 141.24,13.64 IC3.5 | v130.21,18.85 129.15,18.85 128.45,18.15 128.45,16.27 128.49,16.23 128.05,15.79 IC1.5 125.92,15.79 v125.9,15.81
  Top 0.61: J4.22 66.75,90.33 v66.62,90.46
  Top 0.813: GPIO.17 68.57,67.33 | GPIO.1 68.57,85.13 68.57,67.33 | 68.57,67.33 76.38,67.33 78.35,65.36 78.35,34.65 v78.17,34.47
  Top 1.27: MODULE_DIO.A1 MODULE_DIO.B1 MODULE_AIO.A1 MODULE_AIO.B1
  Bottom 0.406: v150.12,93.6 150.12,93.47 150.75,92.84 155.37,92.84 v155.53,92.68
  Bottom 0.508: v155.53,92.68 156.69,92.68 157.03,92.34 158.31,92.34 159.56,91.09 159.56,80.54 157.48,78.46 157.48,25.46 150.67,18.65 150.67,17.19 147.12,13.64 v140.04,13.64 137.13,13.64 131.89,18.88 130.35,18.88 130.32,18.85 v130.21,18.85 | v125.9,15.81 119.65,15.81 117.63,17.83 117.63,28.2 116.58,29.25 114.05,29.25 ETH1.18 107.97,30.51 106.5,31.98 103.95,31.98 103.14,31.17 ETH1.20
  Bottom 0.61: v66.62,90.46 67.31,89.77 GPIO.1
  Bottom 0.813: ETH1.20 99.18,34.47 v90.16,34.47 v78.17,34.47 77.9,34.47 68.3,24.87 60.96,24.87 56.84,20.75 56.84,8.19 54.42,5.77 18.78,5.77 16.51,8.04 MODULE_AIO.A1
+5V  (via drill 0.15)
  Top 0.2: PI1.86 PI1.88 138.74,96.37 138.74,94.37 PI1.78 PI1.80 | PI1.86 PI1.84 | PI1.84 PI1.82 | PI1.82 PI1.80 | PI1.86 141.2,95.97 v141.2,95.9 141.2,95.57 PI1.84 | PI1.82 141.2,95.17 v141.2,94.8 141.2,94.77 PI1.80 | IC5.3 152.08,17.66 C20.1 | TP-5VP.TP 158.35,95.35 v158.3,95.4 | v186.65,101.2 186.66,101.18 C21.1 | v127.07,100.18 127.11,100.2 127.11,100.98 | 81.61,25.44 81.61,25.32 | v127.86,100.22 127.89,100.2 v127.84,100.98 127.89,101.77 v127.85,101.79 | v127.03,101.78 127.01,101.77 127.01,100.98 | v112.89,103.36 112.95,103.33 112.95,104.13 112.95,104.89 v112.93,104.9 | v113.77,103.35 113.83,103.33 113.83,104.11 | 113.83,104.11 v113.78,104.11 | 113.83,104.11 113.83,104.13 113.83,104.89 v113.79,104.91 | 174.8,106.6 174.8,105.78 173.8,104.78 173.8,102.1 176.1,102.1 176.1,104.6 175.1,105.6 175.1,106.6 174.8,106.6 | 179.6,106.7 179.6,105.9 178.1,104.4 178.1,102.1 180.1,102.1 180.1,105.2 179.9,105.4 179.9,106.7 179.6,106.7
  Top 0.203: USBC.A9 USBC.B4 | USBC.B9 179.77,106.58 USBC.A4
  Top 0.221: 80.42,25.25 80.42,22 80.52,21.9 81.09,21.9 82.82,23.63 82.82,25.33 82.71,25.44 81.61,25.44 80.5,25.44 | FAN.4 159.07,68.42 v159.25,68.24
  Top 0.406: C20.1 151.89,19.3 C18.1 151.69,19.65 151.69,21.51 C19.1 | 81.08,25.32 IC2.1 | TP_5VP.TP 123.4,24.2 123.4,21.9
  Top 0.508: C3.1 74.32,111.67 IC4.1 | C5.1 82.09,25.32 81.61,25.32 81.08,25.32
  Top 0.61: R1.1 179.5,104.9 179.77,105.17 179.77,106.58 | IC4.1 73.45,110.94 72.82,110.31 72.82,105.41 73.98,104.25 v75.98,104.25 | v186.67,100.37 186.67,101.09 186.62,101.14 C21.1 186.62,102.03 v186.67,102.08
  Top 1.27: v153.53,19.61 151.73,19.61 151.69,19.65 | C18.1 151.68,21.5 151.69,21.51 | v115.32,21.9 123.4,21.9 144.34,21.9 146.71,24.27 150.91,24.27 151.69,23.49 C19.1 | MODULE_AIO.B9 MODULE_AIO.B8 | MODULE_DIO.B9 MODULE_DIO.B8
  Top 2.54: v127.84,100.98 127.11,100.98 127.01,100.98 126.88,100.98 123.73,104.13 113.83,104.13 112.95,104.13 v112.91,104.13
  Bottom 0.2: v178.5,104.1 178.56,104.11 178.56,103.3 | v186.67,102.93 186.66,102.94 185.89,103.3 | v175.7,103.3 175.72,103.33 175.72,103.3 | MODULE_AIO.B9 13.96,45.73 13.96,44.68
  Bottom 1.27: v158.3,95.4 160.79,92.91 160.79,79.69 159.25,78.15 v159.25,68.24 159.25,25.24 153.62,19.61 v153.53,19.61 | v80.88,23.66 v80.87,23.67 v80.87,24.48 v81.72,24.48 v81.73,24.49 v82.51,24.49 80.86,22.84 v80.86,22.75 80.86,23.64 v80.88,23.66 | v80.88,23.66 81.68,23.66 v81.72,23.7 83.49,21.93 115.29,21.93 v115.32,21.9
  Bottom 1.4: 38.67,44.64 38.67,45.05 MODULE_DIO.A9 | MODULE_DIO.A9 MODULE_DIO.B9 | MODULE_DIO.B8 MODULE_DIO.A8 MODULE_DIO.A9 | MODULE_AIO.B9 MODULE_AIO.A9 | MODULE_AIO.B8 MODULE_AIO.A8
  Bottom 2: v139.7,95.4 144.12,95.4
  Bottom 2.54: 69.85,98.12 GPIO.2 GPIO.4 | 69.85,98.12 v75.98,104.25 81.59,104.25 82.28,103.56 93.68,103.56 94.25,104.13 v112.91,104.13 113.9,104.13 | v127.03,100.99 v127.04,100.98 v127.84,100.98 128.1,100.98 128.12,101 141.73,101 143.5,99.23 143.5,96.02 144.12,95.4 v158.3,95.4 166.2,103.3 v175.7,103.3 175.72,103.3 v178.5,103.3 178.56,103.3 185.89,103.3 186.67,102.52 v186.67,100.37 | 69.85,98.12 69.85,98.69 69.6,98.94 69.6,98.99 64.65,103.94 58.5,103.94 55.72,106.72 55.72,110.79 54.72,111.79 CON3.2 CON3.1 46.02,111.79 40.88,106.65 11.66,106.65 8.8,103.79 8.8,46.12 10.24,44.68 13.96,44.68 38.63,44.68 38.67,44.64
  other vias: 139.2,95.9 139.2,94.8 140.2,94.8 140.2,95.9 140.7,95.4 178.5,102.5 175.7,102.5 175.7,104.1 174.1,102.5 174.9,102.5
  pour Top (isolate 0.203, no thermals): 138.74,96.37 138.74,94.37 142.61,94.37 142.61,96.37
  pour Top (isolate 0.203, no thermals): 174.8,105.8 173.8,104.8 173.8,102.1 176.1,102.1 176.1,104.6 175.1,105.6 175.1,106.7 174.8,106.7
  pour Top (isolate 0.203, no thermals): 178.2,102.1 180.1,102.1 180.1,105.4 180,105.5 179.9,105.6 179.9,106.9 179.6,106.9 179.6,105.9 178.3,104.6 178.1,104.4 178.1,102.1
  pour Top (isolate 0.203, no thermals): 80.57,25.1 80.57,25.15 80.71,25.29 82.61,25.29 82.73,25.17 82.73,23.61 81.14,22.02 80.62,22.02 80.53,22.11 80.53,24.99
ADC_RDY
  Top 0.2: CON2.27 50.77,26.79 50.77,27.96 41.59,37.14 41.59,39.87 39.24,42.21 25.19,42.21 16.6,50.8 MODULE_AIO.A11
BT_NDIS
  Top 0.2: JP3.3 111.49,101.24 123.39,101.24 127.46,97.17 PI1.92
CAM_GPIO0  (via drill 0.15)
  Top 0.16: v92.29,76.41 92.64,76.06 J3.17 | v140.31,99.22 141.16,98.37 PI1.98
  Bottom 0.16: v92.29,76.41 92.75,76.87 95.99,76.87 96.48,76.38 106.61,76.38 107.47,77.24 108.83,77.24 109.33,76.74 113.39,76.74 130.99,94.33 134.87,94.33 135.74,95.2 137.41,95.2 137.7,95.49 137.7,97.43 137.46,97.67 137.46,99.02 137.84,99.4 140.12,99.4 v140.31,99.22
CAM_GPIO1  (via drill 0.15)
  Top 0.16: J3.18 v92.14,40.41 v92.13,40.4 | v93.2,76.27 93.04,76.11 93.04,46.73 v93.32,46.45 | v138.05,98.69 138.3,98.94 138.3,99.74 140.54,101.97 147.09,101.97 v147.33,102.22 | v146.55,100.04 146.55,99.44 145.88,98.77 PI1.99
  Bottom 0.16: v92.13,40.4 92.13,45.15 93.32,46.34 v93.32,46.45 | v93.2,76.27 93.44,76.03 106.75,76.03 107.61,76.89 108.69,76.89 109.18,76.39 113.54,76.39 131.13,93.98 135.02,93.98 135.88,94.85 137.81,94.85 138.05,95.09 138.05,97.58 138.04,97.58 138.04,98.42 138.06,98.44 v138.06,98.68 v138.05,98.69 | v147.33,102.22 146.55,101.44 v146.55,100.04
CC1  (via drill 0.15)
  Top 0.2: USBC.A5 178.61,105.49 177.69,104.57 177.69,101.88 178.19,101.38 v178.65,101.38 | PI1.93 147.58,97.57 149.51,99.5 v149.53,99.5 | v152.95,100.02 154.15,101.22 174.06,101.22 174.26,101.02 v174.36,101.02
  Bottom 0.2: v149.53,99.5 152.43,99.5 v152.95,100.02 | v174.36,101.02 178.29,101.02 v178.65,101.38
CC2  (via drill 0.15)
  Top 0.2: USBC.B5 175.61,105.74 176.5,104.85 176.5,101.89 176.29,101.68 153.56,101.68 v153,101.12 | v149.66,100.35 149.49,100.35 147.11,97.97 PI1.95
  Bottom 0.2: v153,101.12 152.23,100.35 v149.66,100.35
DAC_!CLR
  Bottom 0.2: CON2.17 50.77,39.48 47.05,39.48 39.24,47.29 21.48,47.29 16.4,52.37 16.01,52.37 15.03,53.34 15.03,54.91 14.06,55.88 MODULE_AIO.B13
DAC_!LDAC
  Top 0.2: CON2.19 50.77,36.94 49.59,36.94 39.64,46.9 21.87,46.9 16.4,52.37 15.03,52.37 14.06,53.34 MODULE_AIO.B12
DIO_EN
  Top 0.2: CON3.29 50.77,76.19 50.77,75.02 41.2,65.45 41.2,52.66 39.44,50.9 MODULE_DIO.A11
DIO_LEVEL_SELECT
  Top 0.2: CON3.25 50.77,81.26 50.77,80.09 40.42,69.74 40.42,56.95 39.44,55.98 MODULE_DIO.A13
DIO_RESET
  Top 0.2: MODULE_DIO.A12 40.81,54.81 40.81,67.6 50.77,77.55 50.77,78.72 CON3.27
DPHY0_DSIC_N  (via drill 0.15)
  Top 0.121: PI1.128 107.56,84.33 107.52,84.37 102.42,84.37 98.31,80.26 98.31,69.78 arc90 98.46,69.62 98.53,69.62 arc-90 99,69.15 99,69.11 arc-90 98.53,68.65 98.46,68.65 arc90 98.31,68.49 98.31,68.45 arc90 98.46,68.29 98.53,68.29 arc-90 99,67.83 99,67.79 arc-90 98.53,67.32 98.46,67.32 arc90 98.31,67.16 98.31,67.12 arc90 98.46,66.97 98.53,66.97 arc-90 99,66.5 99,66.46 arc-90 98.53,66 98.46,66 arc90 98.31,65.84 98.31,65.8 arc90 98.46,65.64 98.53,65.64 arc-90 99,65.18 99,65.14 arc-90 98.53,64.67 98.46,64.67 arc90 98.31,64.52 98.31,64.47 arc90 98.46,64.32 98.53,64.32 arc-90 99,63.85 99,63.81 arc-90 98.53,63.35 98.46,63.35 arc90 98.31,63.19 98.31,63.15 arc90 98.46,62.99 98.53,62.99 arc-90 99,62.53 99,62.49 arc-90 98.53,62.02 98.46,62.02 arc90 98.31,61.87 98.31,61.83 arc90 98.46,61.67 98.53,61.67 arc-90 99,61.2 99,61.16 arc-90 98.53,60.7 98.46,60.7 arc90 98.31,60.54 98.31,51.14 v98.57,51.14 | J3.8 97.14,42.94 v97.33,43.13
  Bottom 0.121: v98.57,51.14 98.31,51.14 98.31,47.74 97.87,47.3 97.87,43.67 97.44,43.24 97.33,43.24 v97.33,43.13
DPHY0_DSIC_P  (via drill 0.15)
  Top 0.121: PI1.130 107.56,84.73 107.52,84.69 102.3,84.69 97.99,80.38 97.99,69.78 arc90 98.46,69.31 98.53,69.31 arc-90 98.68,69.15 98.68,69.11 arc-90 98.53,68.96 98.46,68.96 arc90 97.99,68.49 97.99,68.45 arc90 98.46,67.98 arc-90 98.62,67.83 98.62,67.79 arc-90 98.46,67.63 arc90 97.99,67.16 97.99,67.12 arc90 98.46,66.66 arc-90 98.62,66.5 98.62,66.46 arc-90 98.46,66.31 arc90 97.99,65.84 97.99,65.8 arc90 98.46,65.33 98.46,65.33 arc-90 98.62,65.18 98.62,65.14 arc-90 98.46,64.98 98.46,64.98 arc90 97.99,64.52 97.99,64.47 arc90 98.46,64.01 98.53,64.01 arc-90 98.68,63.85 98.68,63.81 arc-90 98.53,63.66 98.46,63.66 arc90 97.99,63.19 97.99,63.15 arc90 98.46,62.68 98.53,62.68 arc-90 98.68,62.53 98.68,62.49 arc-90 98.53,62.33 98.46,62.33 arc90 97.99,61.87 97.99,61.83 arc90 98.46,61.36 98.53,61.36 arc-90 98.68,61.2 98.68,61.16 arc-90 98.53,61.01 98.46,61.01 arc90 97.99,60.54 97.99,51.14 v97.73,51.14 | J3.9 v96.64,43.65 v96.65,43.64
  Bottom 0.121: v97.73,51.14 97.99,51.14 97.99,47.86 97.55,47.42 97.55,43.98 97.31,43.74 96.65,43.74 v96.65,43.64
DPHY0_DSID0_N  (via drill 0.15)
  Top 0.121: PI1.116 107.5,81.93 107.47,81.96 101.91,81.96 101.05,81.1 101.05,69.32 arc90 101.2,69.16 101.98,69.16 arc-90 102.45,68.69 102.45,68.62 arc-90 101.98,68.15 101.2,68.15 arc90 101.05,67.99 101.05,67.91 arc90 101.2,67.76 101.98,67.76 arc-90 102.45,67.29 102.45,67.22 arc-90 101.98,66.75 101.2,66.75 arc90 101.05,66.59 101.05,66.51 arc90 101.2,66.36 101.98,66.36 arc-90 102.45,65.89 102.45,65.81 arc-90 101.98,65.35 101.2,65.35 arc90 101.05,65.19 101.05,65.11 arc90 101.2,64.96 101.98,64.96 arc-90 102.45,64.49 102.45,64.41 arc-90 101.98,63.95 101.2,63.95 arc90 101.05,63.79 101.05,51.15 v101.31,51.15 | v100.6,43.13 100.27,43.13 100.11,42.97 100.11,41.91 J3.2
  Bottom 0.121: v101.31,51.15 101.05,51.15 101.05,43.96 100.56,43.47 100.56,43.17 v100.6,43.13
DPHY0_DSID0_P  (via drill 0.15)
  Top 0.121: PI1.118 107.52,82.33 107.47,82.28 101.79,82.28 100.73,81.22 100.73,69.32 arc90 101.2,68.85 101.98,68.85 arc-90 102.14,68.69 102.14,68.62 arc-90 101.98,68.46 101.2,68.46 arc90 100.73,67.99 100.73,67.91 arc90 101.2,67.45 101.96,67.45 arc-90 102.11,67.29 102.11,67.22 arc-90 101.96,67.06 101.2,67.06 arc90 100.73,66.59 100.73,66.51 arc90 101.2,66.05 101.98,66.05 arc-90 102.14,65.89 102.14,65.81 arc-90 101.98,65.66 101.2,65.66 arc90 100.73,65.19 100.73,65.11 arc90 101.2,64.65 101.98,64.65 arc-90 102.14,64.49 102.14,64.41 arc-90 101.98,64.26 101.2,64.26 arc90 100.73,63.79 100.73,51.15 v100.47,51.15 | J3.3 99.64,43.91 v99.9,43.65
  Bottom 0.121: v100.47,51.15 100.73,51.15 100.73,44.09 100.3,43.65 v99.9,43.65
DPHY0_DSID1_N  (via drill 0.15)
  Top 0.121: PI1.122 107.45,83.13 107.41,83.17 102.16,83.17 99.71,80.72 99.71,66.97 arc90 99.86,66.81 99.91,66.81 arc-90 100.38,66.35 100.38,66.28 arc-90 99.91,65.81 99.86,65.81 arc90 99.71,65.66 99.71,65.59 arc90 99.86,65.43 99.91,65.43 arc-90 100.38,64.97 100.38,64.9 arc-90 99.91,64.43 99.86,64.43 arc90 99.71,64.27 99.71,64.21 arc90 99.86,64.05 99.91,64.05 arc-90 100.38,63.58 100.38,63.51 arc-90 99.91,63.05 99.86,63.05 arc90 99.71,62.89 99.71,62.82 arc90 99.86,62.67 99.91,62.67 arc-90 100.38,62.2 100.38,62.13 arc-90 99.91,61.66 99.86,61.66 arc90 99.71,61.51 99.71,61.44 arc90 99.86,61.28 99.91,61.28 arc-90 100.38,60.82 100.38,60.75 arc-90 99.91,60.28 99.86,60.28 arc90 99.71,60.13 99.71,60.06 arc90 99.86,59.9 99.91,59.9 arc-90 100.38,59.44 100.38,59.37 arc-90 99.91,58.9 99.86,58.9 arc90 99.71,58.74 99.71,58.68 arc90 99.86,58.52 99.91,58.52 arc-90 100.38,58.05 100.38,57.99 arc-90 99.91,57.52 99.86,57.52 arc90 99.71,57.36 99.71,57.29 arc90 99.86,57.14 99.91,57.14 arc-90 100.38,56.67 100.38,56.6 arc-90 99.91,56.14 99.86,56.14 arc90 99.71,55.98 99.71,55.91 arc90 99.86,55.76 99.91,55.76 arc-90 100.38,55.29 100.38,55.22 arc-90 99.91,54.75 99.86,54.75 arc90 99.71,54.6 99.71,50.11 v99.97,50.11 | J3.5 98.64,43.87 v99.08,43.44
  Bottom 0.121: v99.97,50.11 99.71,50.11 99.71,47.49 98.55,46.33 98.55,43.97 v99.08,43.44
DPHY0_DSID1_P  (via drill 0.15)
  Top 0.121: PI1.124 107.45,83.53 107.41,83.49 102.04,83.49 99.39,80.84 99.39,66.97 arc90 99.86,66.5 99.91,66.5 arc-90 100.07,66.35 100.07,66.28 arc-90 99.91,66.12 99.86,66.12 arc90 99.39,65.66 99.39,65.59 arc90 99.86,65.12 99.91,65.12 arc-90 100.07,64.97 100.07,64.9 arc-90 99.91,64.74 99.86,64.74 arc90 99.39,64.27 99.39,64.21 arc90 99.86,63.74 99.91,63.74 arc-90 100.07,63.58 100.07,63.51 arc-90 99.91,63.36 99.86,63.36 arc90 99.39,62.89 99.39,62.82 arc90 99.86,62.36 99.91,62.36 arc-90 100.07,62.2 100.07,62.13 arc-90 99.91,61.98 99.86,61.98 arc90 99.39,61.51 99.39,61.44 arc90 99.86,60.97 99.91,60.97 arc-90 100.07,60.82 100.07,60.75 arc-90 99.91,60.59 99.86,60.59 arc90 99.39,60.13 99.39,60.06 arc90 99.86,59.59 99.87,59.59 arc-90 100.03,59.44 100.03,59.37 arc-90 99.87,59.21 99.86,59.21 arc90 99.39,58.74 99.39,58.68 arc90 99.86,58.21 arc-90 100.02,58.05 100.02,57.99 arc-90 99.86,57.83 arc90 99.39,57.36 99.39,57.29 arc90 99.86,56.83 arc-90 100.02,56.67 100.02,56.6 arc-90 99.86,56.45 arc90 99.39,55.98 99.39,55.91 arc90 99.86,55.45 99.91,55.45 arc-90 100.07,55.29 100.07,55.22 arc-90 99.91,55.06 99.86,55.06 arc90 99.39,54.6 99.39,50.11 v99.13,50.11 | v98.23,43.18 98.14,43.09 J3.6
  Bottom 0.121: v99.13,50.11 99.39,50.11 99.39,47.61 98.21,46.43 98.21,43.2 v98.23,43.18
DPHY0_DSID2_N  (via drill 0.15)
  Top 0.121: PI1.134 107.39,85.53 107.36,85.56 102.63,85.56 96.66,79.59 96.66,70.28 arc-90 96.19,69.81 arc90 96.03,69.66 96.03,69.38 arc90 96.19,69.22 96.81,69.22 arc-90 97.28,68.75 97.28,68.47 arc-90 96.81,68.01 96.19,68.01 arc90 96.03,67.85 96.03,67.57 arc90 96.19,67.42 arc-90 96.66,66.95 96.66,65.52 arc-90 96.19,65.05 96.07,65.05 arc90 95.92,64.9 95.92,64.69 arc90 96.07,64.53 96.19,64.53 arc-90 96.66,64.07 96.66,63.86 arc-90 96.19,63.39 96.07,63.39 arc90 95.92,63.24 95.92,63.03 arc90 96.07,62.88 96.19,62.88 arc-90 96.66,62.41 96.66,49.99 v96.92,49.99 | v95.81,43.51 95.64,43.68 J3.11
  Bottom 0.121: v96.92,49.99 96.66,49.99 96.66,47.6 95.85,46.8 95.85,44.1 95.81,44.06 v95.81,43.51
DPHY0_DSID2_P  (via drill 0.15)
  Top 0.121: PI1.136 107.41,85.93 107.36,85.88 102.51,85.88 96.34,79.71 96.34,70.28 arc-90 96.19,70.12 arc90 95.72,69.66 95.72,69.38 arc90 96.19,68.91 96.34,68.91 arc-90 96.49,68.75 96.49,68.47 arc-90 96.34,68.32 96.19,68.32 arc90 95.72,67.85 95.72,67.57 arc90 96.19,67.11 arc-90 96.34,66.95 96.34,65.52 arc-90 96.19,65.36 96.07,65.36 arc90 95.61,64.9 95.61,64.69 arc90 96.07,64.22 96.19,64.22 arc-90 96.34,64.07 96.34,63.86 arc-90 96.19,63.71 96.07,63.71 arc90 95.61,63.24 95.61,63.03 arc90 96.07,62.57 96.19,62.57 arc-90 96.34,62.41 96.34,49.99 v96.08,49.99 | v95.03,43.12 95.03,41.99 J3.12
  Bottom 0.121: v96.08,49.99 96.34,49.99 96.34,47.73 95.54,46.93 95.54,44.23 95.03,43.72 v95.03,43.12
DPHY0_DSID3_N  (via drill 0.15)
  Top 0.121: PI1.140 107.48,86.73 107.43,86.78 102.94,86.78 95.13,78.97 95.13,69.38 arc-90 94.66,68.91 94.36,68.91 arc90 94.2,68.75 94.2,68.6 arc90 94.36,68.45 94.66,68.45 arc-90 95.13,67.98 95.13,67.83 arc-90 94.66,67.36 94.36,67.36 arc90 94.2,67.2 94.2,67.05 arc90 94.36,66.9 94.66,66.9 arc-90 95.13,66.43 95.13,51.06 v95.39,51.06 | v94.15,43.1 94.15,41.89 J3.14
  Bottom 0.121: v95.39,51.06 95.14,51.06 95.13,51.05 95.13,44.29 94.15,43.31 v94.15,43.1
DPHY0_DSID3_P  (via drill 0.15)
  Top 0.121: PI1.142 107.46,87.13 107.43,87.1 102.82,87.1 94.81,79.09 94.81,69.38 arc-90 94.66,69.22 94.36,69.22 arc90 93.89,68.75 93.89,68.6 arc90 94.36,68.14 94.36,68.14 arc-90 94.52,67.98 94.52,67.83 arc-90 94.36,67.67 94.36,67.67 arc90 93.89,67.2 93.89,67.05 arc90 94.36,66.59 94.66,66.59 arc-90 94.81,66.43 94.81,51.06 v94.55,51.06 | J3.15 93.57,44.81 93.57,43.77 v93.44,43.64
  Bottom 0.121: v94.55,51.06 94.8,51.06 94.81,51.05 94.81,44.41 94.1,43.7 93.5,43.7 v93.44,43.64
DPHY1_DSIC_N  (via drill 0.15)
  Top 0.121: PI1.188 107.56,96.33 107.53,96.36 105.64,96.36 arc90 105.48,96.21 105.48,95.74 arc-90 105.02,95.28 104.97,95.28 arc-90 104.5,95.74 104.5,96.16 arc90 104.35,96.32 104.3,96.32 arc90 104.14,96.16 104.14,95.74 arc-90 103.68,95.28 103.63,95.28 arc-90 103.16,95.74 103.16,96.21 arc90 103.01,96.36 102.96,96.36 arc90 102.8,96.21 102.8,95.74 arc-90 102.34,95.28 102.29,95.28 arc-90 101.82,95.74 101.82,96.21 arc90 101.67,96.36 101.62,96.36 arc90 101.47,96.21 101.47,95.74 arc-90 101,95.28 100.95,95.28 arc-90 100.48,95.74 100.48,96.21 arc90 100.33,96.36 100.28,96.36 arc90 100.12,96.21 100.12,95.74 arc-90 99.66,95.28 99.61,95.28 arc-90 99.14,95.74 99.14,96.21 arc90 98.99,96.36 98.94,96.36 arc90 98.79,96.21 98.79,95.74 arc-90 98.32,95.28 98.27,95.28 arc-90 97.81,95.74 97.81,96.21 arc90 97.65,96.36 97.6,96.36 arc90 97.45,96.21 97.45,95.74 arc-90 96.98,95.28 96.93,95.28 arc-90 96.47,95.74 96.47,96.21 arc90 96.31,96.36 95.99,96.36 82.98,83.35 82.51,83.35 v82.51,83.09 | J4.8 77.27,83.33 v77.7,82.89
  Bottom 0.121: v82.51,83.09 82.51,83.35 81.11,83.35 80.38,82.62 78.37,82.62 77.9,83.09 v77.7,82.89
DPHY1_DSIC_P  (via drill 0.15)
  Top 0.121: PI1.190 107.58,96.73 107.53,96.68 105.64,96.68 arc90 105.17,96.21 105.17,95.74 arc-90 105.02,95.59 104.97,95.59 arc-90 104.81,95.74 104.81,96.21 arc90 104.35,96.68 104.3,96.68 arc90 103.83,96.21 103.83,95.74 arc-90 103.68,95.59 103.63,95.59 arc-90 103.47,95.74 103.47,96.21 arc90 103.01,96.68 102.96,96.68 arc90 102.49,96.21 102.49,95.74 arc-90 102.34,95.59 102.29,95.59 arc-90 102.13,95.74 102.13,96.21 arc90 101.67,96.68 101.62,96.68 arc90 101.15,96.21 101.15,95.74 arc-90 101,95.59 100.95,95.59 arc-90 100.8,95.74 100.8,96.21 arc90 100.33,96.68 100.28,96.68 arc90 99.81,96.21 99.81,95.74 arc-90 99.66,95.59 99.61,95.59 arc-90 99.46,95.74 99.46,96.21 arc90 98.99,96.68 98.94,96.68 arc90 98.47,96.21 98.47,95.74 arc-90 98.32,95.59 98.27,95.59 arc-90 98.12,95.74 98.12,96.21 arc90 97.65,96.68 97.6,96.68 arc90 97.14,96.21 97.14,95.74 arc-90 96.98,95.59 96.93,95.59 arc-90 96.78,95.74 96.78,96.21 arc90 96.31,96.68 95.87,96.68 82.86,83.67 82.51,83.67 v82.51,83.93 | J4.9 78.24,83.83 v78.08,83.67
  Bottom 0.121: v82.51,83.93 82.51,83.67 80.99,83.67 80.26,82.94 78.49,82.94 77.92,83.51 v78.08,83.67
DPHY1_DSID0_N  (via drill 0.15)
  Top 0.121: PI1.176 107.56,93.93 107.52,93.97 105.37,93.97 104.18,92.78 97.28,92.78 96.4,91.91 arc-90 95.74,91.91 95.6,92.05 arc90 95.38,92.05 95.36,92.02 arc90 95.36,91.8 95.49,91.67 arc-90 95.49,91 95.47,90.98 arc-90 94.81,90.98 94.67,91.12 arc90 94.45,91.12 94.43,91.09 arc90 94.43,90.87 94.56,90.74 arc-90 94.56,90.07 94.54,90.05 arc-90 93.88,90.05 93.74,90.19 arc90 93.52,90.19 93.5,90.17 arc90 93.5,89.94 93.64,89.81 arc-90 93.64,89.14 93.61,89.12 arc-90 92.95,89.12 92.81,89.26 arc90 92.59,89.26 92.57,89.24 arc90 92.57,89.01 92.71,88.88 arc-90 92.71,88.22 92.69,88.19 arc-90 92.02,88.19 91.89,88.33 arc90 91.66,88.33 91.64,88.31 arc90 91.64,88.08 91.78,87.95 arc-90 91.78,87.29 91.76,87.26 arc-90 91.09,87.26 90.96,87.4 arc90 90.73,87.4 90.71,87.38 arc90 90.71,87.16 90.85,87.02 arc-90 90.85,86.36 90.83,86.33 arc-90 90.16,86.33 90.03,86.47 arc90 89.81,86.47 89.78,86.45 arc90 89.78,86.23 89.92,86.09 arc-90 89.92,85.43 89.9,85.41 arc-90 89.23,85.41 89.1,85.54 arc90 88.88,85.54 88.86,85.52 arc90 88.86,85.3 88.99,85.16 arc-90 88.99,84.5 88.97,84.48 arc-90 88.3,84.48 88.27,84.51 arc90 88.05,84.51 88.03,84.49 arc90 88.03,84.26 88.06,84.23 arc-90 88.06,83.57 88.04,83.55 arc-90 87.38,83.55 arc90 87.15,83.55 87.13,83.53 arc90 87.13,83.31 arc-90 87.13,82.64 87.11,82.62 arc-90 86.45,82.62 86.31,82.75 arc90 86.09,82.75 86.07,82.73 arc90 86.07,82.51 86.2,82.38 arc-90 86.2,81.71 84.8,80.3 81.79,80.3 v81.79,80.04 | J4.2 77.22,80.33 v77.83,79.72
  Bottom 0.121: v81.79,80.04 81.79,80.3 78.81,80.3 78.22,79.72 v77.83,79.72
DPHY1_DSID0_P  (via drill 0.15)
  Top 0.121: PI1.178 107.56,94.33 107.52,94.29 105.25,94.29 104.06,93.1 97.14,93.1 96.18,92.13 arc-90 95.96,92.13 95.82,92.27 arc90 95.16,92.27 95.14,92.24 arc90 95.14,91.58 95.27,91.44 arc-90 95.27,91.22 95.25,91.2 arc-90 95.03,91.2 94.89,91.34 arc90 94.23,91.34 94.21,91.31 arc90 94.21,90.65 94.34,90.52 arc-90 94.34,90.29 94.32,90.27 arc-90 94.1,90.27 93.97,90.41 arc90 93.3,90.41 93.28,90.39 arc90 93.28,89.72 93.41,89.59 arc-90 93.41,89.36 93.39,89.34 arc-90 93.17,89.34 93.04,89.48 arc90 92.37,89.48 92.35,89.46 arc90 92.35,88.79 92.48,88.66 arc-90 92.48,88.44 92.46,88.42 arc-90 92.24,88.42 92.11,88.55 arc90 91.44,88.55 91.42,88.53 arc90 91.42,87.86 91.56,87.73 arc-90 91.56,87.51 91.53,87.49 arc-90 91.31,87.49 91.18,87.62 arc90 90.51,87.62 90.49,87.6 arc90 90.49,86.94 90.63,86.8 arc-90 90.63,86.58 90.61,86.56 arc-90 90.38,86.56 90.25,86.69 arc90 89.58,86.69 89.56,86.67 arc90 89.56,86.01 89.7,85.87 arc-90 89.7,85.65 89.68,85.63 arc-90 89.45,85.63 89.32,85.76 arc90 88.66,85.76 88.63,85.74 arc90 88.63,85.08 88.77,84.94 arc-90 88.77,84.72 88.75,84.7 arc-90 88.53,84.7 88.39,84.83 arc90 87.73,84.83 87.7,84.81 arc90 87.7,84.15 87.84,84.01 arc-90 87.84,83.79 87.82,83.77 arc-90 87.6,83.77 87.46,83.91 arc90 86.8,83.91 86.78,83.88 arc90 86.78,83.22 86.91,83.08 arc-90 86.91,82.86 86.89,82.84 arc-90 86.67,82.84 86.53,82.98 arc90 85.87,82.98 85.85,82.95 arc90 85.85,82.29 85.98,82.16 arc-90 85.98,81.93 84.66,80.62 81.79,80.62 v81.79,80.88 | J4.3 78.4,80.83 v78.09,80.52
  Bottom 0.121: v81.79,80.88 81.79,80.62 78.19,80.62 v78.09,80.52
DPHY1_DSID1_N  (via drill 0.15)
  Top 0.121: v77.74,81.33 78.27,81.33 78.77,81.83 J4.5 | PI1.182 107.51,95.13 107.47,95.17 106.36,95.17 105.83,94.64 105.12,94.64 104.06,93.58 95.1,93.58 91.86,90.34 arc90 91.86,90.12 91.9,90.08 arc-90 91.9,89.42 91.84,89.36 arc-90 91.18,89.36 90.66,89.89 arc90 90.44,89.89 90.38,89.83 arc90 90.38,89.61 90.91,89.08 arc-90 90.91,88.42 90.85,88.36 arc-90 90.19,88.36 89.66,88.89 arc90 89.44,88.89 89.38,88.83 arc90 89.38,88.61 89.91,88.08 arc-90 89.91,87.42 89.85,87.36 arc-90 89.19,87.36 88.66,87.89 arc90 88.44,87.89 88.39,87.83 arc90 88.39,87.61 88.91,87.09 arc-90 88.91,86.42 88.85,86.37 arc-90 88.19,86.37 87.67,86.89 arc90 87.44,86.89 87.39,86.83 arc90 87.39,86.61 87.91,86.09 arc-90 87.91,85.43 87.85,85.37 arc-90 87.19,85.37 86.85,85.7 arc90 86.63,85.7 86.58,85.65 arc90 86.58,85.43 86.91,85.09 arc-90 86.91,84.43 86.85,84.37 arc-90 86.19,84.37 86.15,84.41 arc90 85.93,84.41 83.54,82.02 81.25,82.02 v81.25,81.76
  Bottom 0.121: v81.25,81.76 81.25,82.02 80.83,82.02 80.44,81.63 78.5,81.63 78.19,81.33 v77.74,81.33
DPHY1_DSID1_P  (via drill 0.15)
  Top 0.121: J4.6 76.63,82.11 v78.08,82.11 | PI1.184 107.52,95.53 107.47,95.48 106.24,95.48 105.7,94.95 104.99,94.95 103.93,93.89 94.97,93.89 91.64,90.56 arc90 91.64,89.9 91.68,89.86 arc-90 91.68,89.64 91.62,89.58 arc-90 91.4,89.58 90.88,90.11 arc90 90.22,90.11 90.16,90.05 arc90 90.16,89.39 90.69,88.86 arc-90 90.69,88.64 90.63,88.58 arc-90 90.41,88.58 89.88,89.11 arc90 89.22,89.11 89.16,89.05 arc90 89.16,88.39 89.69,87.86 arc-90 89.69,87.64 89.63,87.58 arc-90 89.41,87.58 88.88,88.11 arc90 88.22,88.11 88.17,88.05 arc90 88.17,87.39 88.69,86.87 arc-90 88.69,86.64 88.63,86.59 arc-90 88.41,86.59 87.89,87.11 arc90 87.22,87.11 87.17,87.05 arc90 87.17,86.39 87.69,85.87 arc-90 87.69,85.65 87.63,85.59 arc-90 87.41,85.59 86.89,86.11 arc90 86.23,86.11 86.17,86.05 arc90 86.17,85.39 86.69,84.87 arc-90 86.69,84.65 86.63,84.59 arc-90 86.41,84.59 86.37,84.63 arc90 85.71,84.63 83.42,82.34 81.25,82.34 v81.25,82.6
  Bottom 0.121: v81.25,82.6 81.25,82.34 80.71,82.34 80.32,81.95 78.54,81.95 78.38,82.11 v78.08,82.11
DPHY1_DSID2_N  (via drill 0.15)
  Top 0.121: PI1.194 107.52,97.53 107.49,97.56 104.86,97.56 arc-90 104.39,98.03 104.39,98.67 arc90 104.23,98.83 104.2,98.83 arc90 104.05,98.67 104.05,98.03 arc-90 103.58,97.56 103.55,97.56 arc-90 103.08,98.03 103.08,98.42 arc90 102.92,98.58 102.89,98.58 arc90 102.74,98.42 102.74,98.03 arc-90 102.27,97.56 102.24,97.56 arc-90 101.77,98.03 101.77,98.67 arc90 101.62,98.83 101.59,98.83 arc90 101.43,98.67 101.43,98.03 arc-90 100.96,97.56 100.93,97.56 arc-90 100.47,98.03 100.47,98.67 arc90 100.31,98.83 100.28,98.83 arc90 100.12,98.67 100.12,98.03 arc-90 99.66,97.56 99.62,97.56 arc-90 99.16,98.03 99.16,98.67 arc90 99,98.83 98.97,98.83 arc90 98.81,98.67 98.81,98.03 arc-90 98.35,97.56 98.32,97.56 arc-90 97.85,98.03 97.85,98.67 arc90 97.69,98.83 97.66,98.83 arc90 97.51,98.67 97.51,98.03 arc-90 97.04,97.56 96.19,97.56 83.4,84.77 81.66,84.77 v81.66,84.51 | 77.81,84.52 v77.76,84.47 78.12,84.83 J4.11
  Bottom 0.121: v81.66,84.51 81.66,84.77 77.79,84.77 77.79,84.5 v77.76,84.47
DPHY1_DSID2_P  (via drill 0.15)
  Top 0.121: PI1.196 107.54,97.93 107.49,97.88 104.86,97.88 arc-90 104.7,98.03 104.7,98.67 arc90 104.23,99.14 104.2,99.14 arc90 103.73,98.67 103.73,98.03 arc-90 103.58,97.88 103.55,97.88 arc-90 103.39,98.03 103.39,98.67 arc90 102.92,99.14 102.89,99.14 arc90 102.43,98.67 102.43,98.03 arc-90 102.27,97.88 102.24,97.88 arc-90 102.08,98.03 102.08,98.67 arc90 101.62,99.14 101.59,99.14 arc90 101.12,98.67 101.12,98.03 arc-90 100.96,97.88 100.93,97.88 arc-90 100.78,98.03 100.78,98.67 arc90 100.31,99.14 100.28,99.14 arc90 99.81,98.67 99.81,98.03 arc-90 99.66,97.88 99.62,97.88 arc-90 99.47,98.03 99.47,98.67 arc90 99,99.14 98.97,99.14 arc90 98.5,98.67 98.5,98.03 arc-90 98.35,97.88 98.32,97.88 arc-90 98.16,98.03 98.16,98.67 arc90 97.69,99.14 97.66,99.14 arc90 97.2,98.67 97.2,98.03 arc-90 97.04,97.88 96.07,97.88 83.28,85.09 81.66,85.09 v81.66,85.35 | v77.8,85.36 77.8,85.33 J4.12
  Bottom 0.121: v81.66,85.35 81.66,85.09 77.8,85.09 v77.8,85.36
DPHY1_DSID3_N  (via drill 0.15)
  Top 0.121: PI1.193 111.87,97.53 111.91,97.57 113.47,97.57 113.68,97.78 114.12,97.78 v114.12,97.52 | v94.27,97.52 94.01,97.78 94.01,97.27 84.04,87.3 v84.23,87.11 | v77.65,86.37 77.61,86.33 J4.14
  Bottom 0.121: v114.12,97.52 114.12,97.78 104.13,97.78 arc-90 103.66,98.25 103.66,98.34 arc90 103.51,98.49 103.23,98.49 arc90 103.08,98.34 103.08,98.25 arc-90 102.61,97.78 102.34,97.78 arc-90 101.87,98.25 101.87,98.36 arc90 101.72,98.52 101.44,98.52 arc90 101.29,98.36 101.29,98.25 arc-90 100.82,97.78 94.01,97.78 v94.27,97.52 | v84.23,87.11 84.04,87.3 82.67,85.93 78.49,85.93 78.05,86.37 v77.65,86.37
DPHY1_DSID3_P  (via drill 0.15)
  Top 0.121: PI1.195 111.87,97.93 111.91,97.89 113.35,97.89 113.56,98.1 114.12,98.1 v114.12,98.36 | v93.51,98.28 93.69,98.1 93.69,97.39 83.82,87.52 v83.63,87.71 | v78.11,87.09 78.36,86.83 J4.15
  Bottom 0.121: v114.12,98.36 114.12,98.1 104.13,98.1 arc-90 103.97,98.25 103.97,98.36 arc90 103.51,98.83 103.23,98.83 arc90 102.77,98.36 102.77,98.25 arc-90 102.61,98.1 102.34,98.1 arc-90 102.18,98.25 102.18,98.36 arc90 101.72,98.83 101.44,98.83 arc90 100.97,98.36 100.97,98.25 arc-90 100.82,98.1 93.69,98.1 v93.51,98.28 | v83.63,87.71 83.82,87.52 82.55,86.25 78.63,86.25 78.27,86.61 78.27,86.93 v78.11,87.09
EEPROM_NWP
  Top 0.16: PI1.19 146.69,82.77 147.04,83.12 151,83.12 151.99,84.11 151.99,106.11 153.43,107.55 161.39,107.55 JP2.4
ETH_LEDG  (via drill 0.15)
  Top 0.16: PI1.18 140.93,82.37 140.43,81.88 137.24,81.88 135.53,80.16 134.66,80.16 v134.6,80.22 | v104.08,34.12 104.06,34.1 R8.1
  Bottom 0.16: v134.6,80.22 134.49,80.11 134.49,79.05 108.63,53.19 108.63,39.61 104.08,35.07 v104.08,34.12
ETH_LEDY  (via drill 0.15)
  Top 0.16: PI1.16 141.08,81.97 140.59,81.48 137.39,81.48 135.66,79.75 135.37,79.75 v135.13,79.52 | v114.51,34.12 116.06,34.12 116.64,33.54 R9.2
  Bottom 0.16: v135.13,79.52 135.13,79.19 108.99,53.05 108.99,39.71 114.51,34.19 v114.51,34.12
ETH_TX1_N  (via drill 0.15)
  Top 0.121: 107.11,27.97 ETH1.TD1- 107.11,28.06 107.11,33.49 | v110.43,52.11 110.43,51.65 107.11,48.32 107.11,47.68 arc-90 106.64,47.22 106.62,47.22 arc90 106.47,47.06 106.47,47.06 arc90 106.62,46.9 107.28,46.9 arc-90 107.74,46.44 107.74,46.43 arc-90 107.28,45.97 106.62,45.97 arc90 106.47,45.81 106.47,45.81 arc90 106.62,45.65 107.28,45.65 arc-90 107.74,45.18 107.74,45.18 arc-90 107.28,44.71 106.62,44.71 arc90 106.47,44.56 106.47,44.56 arc90 106.62,44.4 106.64,44.4 arc-90 107.11,43.93 107.11,42.78 arc-90 106.64,42.31 106.54,42.31 arc90 106.39,42.15 106.39,42.1 arc90 106.54,41.94 106.64,41.94 arc-90 107.11,41.47 107.11,41.41 arc-90 106.64,40.95 106.56,40.95 arc90 106.4,40.79 106.4,40.73 arc90 106.56,40.58 106.64,40.58 arc-90 107.11,40.11 107.11,34.26 | PI1.9 144.93,80.8 148.17,80.8 v148.17,80.54 | 107.11,34.26 107.11,33.49 | D2.9 107.19,34.3 arc45 107.11,34.26 | D2.2 arc45 107.14,33.49 107.11,33.49
  Bottom 0.121: v110.43,52.11 110.17,52.11 110.17,53.3 137.67,80.8 148.17,80.8 v148.17,80.54
ETH_TX1_P  (via drill 0.15)
  Top 0.121: ETH1.TD1+ 105.76,27.97 106.79,29 106.79,33.51 | v109.59,52.11 109.59,51.25 106.79,48.45 106.79,47.68 arc-90 106.64,47.53 106.62,47.53 arc90 106.16,47.06 106.16,47.06 arc90 106.62,46.59 arc-90 106.78,46.44 106.78,46.43 arc-90 106.62,46.28 arc90 106.16,45.81 106.16,45.81 arc90 106.62,45.34 107.27,45.34 arc-90 107.42,45.18 107.42,45.18 arc-90 107.27,45.03 106.62,45.03 arc90 106.16,44.56 106.16,44.56 arc90 106.62,44.09 106.64,44.09 arc-90 106.79,43.93 106.79,42.78 arc-90 106.64,42.62 106.54,42.62 arc90 106.08,42.15 106.08,42.1 arc90 106.54,41.63 106.64,41.63 arc-90 106.79,41.47 106.79,41.41 arc-90 106.64,41.26 106.54,41.26 arc90 106.08,40.79 106.08,40.73 arc90 106.54,40.27 106.64,40.27 arc-90 106.79,40.11 106.79,34.26 | v148.19,81.4 148.19,81.14 144.93,81.14 PI1.11 | 106.79,34.26 106.79,33.51 | D2.10 | D2.10 arc45 106.79,34.26 | D2.1 106.74,33.49 arc-45 106.79,33.51
  Bottom 0.121: v109.59,52.11 109.85,52.11 109.85,53.42 137.57,81.14 148.19,81.14 v148.19,81.4
ETH_TX2_N  (via drill 0.15)
  Top 0.121: ETH1.TD2- 107.62,26.87 108.26,26.87 108.77,27.38 108.77,32.43 108.29,32.9 108.29,33.44 | v110.91,51.15 111.17,51.15 111.17,50.63 108.29,47.75 108.29,44.42 arc-90 108.14,44.27 108.04,44.27 arc90 107.57,43.8 107.57,43.55 arc90 108.04,43.08 108.14,43.08 arc-90 108.29,42.93 108.29,42.68 arc-90 108.14,42.52 108.04,42.52 arc90 107.57,42.05 107.57,41.8 arc90 108.04,41.34 108.14,41.34 arc-90 108.29,41.18 108.29,39.55 arc-90 108.14,39.39 108.11,39.39 arc90 107.64,38.92 107.64,38.92 arc90 108.11,38.45 108.65,38.45 arc-90 108.81,38.29 108.81,38.28 arc-90 108.65,38.13 108.11,38.13 arc90 107.64,37.66 107.64,37.65 arc90 108.11,37.19 arc-90 108.26,37.03 108.26,37.02 arc-90 108.11,36.87 arc90 107.64,36.4 107.64,36.39 arc90 108.11,35.92 108.14,35.92 arc-90 108.29,35.77 108.29,34.29 | v147.15,80.21 147.15,79.93 144.94,79.93 PI1.5 | 108.29,33.44 108.29,34.29 | D2.4 arc45 108.26,33.44 108.29,33.44 | D2.7 arc45 108.23,34.29 108.29,34.29
  Bottom 0.121: v110.91,51.15 111.17,51.15 111.17,53.83 137.67,80.33 143.99,80.33 144.38,79.94 147.15,79.94 v147.15,80.21
ETH_TX2_P  (via drill 0.15)
  Top 0.121: ETH1.TD2+ 108.21,26.35 109.09,27.23 109.09,32.55 108.61,33.04 108.61,33.45 | v111.75,51.15 111.49,51.15 111.49,50.51 108.61,47.63 108.61,44.42 arc-90 108.14,43.96 108.04,43.96 arc90 107.88,43.8 107.88,43.55 arc90 108.04,43.39 108.14,43.39 arc-90 108.61,42.93 108.61,42.68 arc-90 108.14,42.21 108.06,42.21 arc90 107.9,42.05 107.9,41.8 arc90 108.06,41.65 108.14,41.65 arc-90 108.61,41.18 108.61,39.55 arc-90 108.14,39.08 108.11,39.08 arc90 107.95,38.92 107.95,38.92 arc90 108.11,38.76 108.8,38.76 arc-90 109.26,38.29 109.26,38.28 arc-90 108.8,37.82 108.11,37.82 arc90 107.95,37.66 107.95,37.65 arc90 108.11,37.5 108.8,37.5 arc-90 109.26,37.03 109.26,37.02 arc-90 108.8,36.55 108.11,36.55 arc90 107.95,36.4 107.95,36.39 arc90 108.11,36.23 108.14,36.23 arc-90 108.61,35.77 108.61,34.31 | v147.15,79.35 147.15,79.59 144.92,79.59 PI1.3 | 108.61,33.45 108.61,34.31 | D2.6 108.65,34.3 arc-45 108.61,34.31 | D2.5 108.65,33.46 arc45 108.61,33.45
  Bottom 0.121: v111.75,51.15 111.49,51.15 111.49,53.7 137.8,80.01 143.87,80.01 144.29,79.59 147.15,79.59 v147.15,79.35
ETH_TX3_N  (via drill 0.15)  (2 unrouted)
  Top 0.121: PI1.10 141.46,80.77 141.41,80.82 137.96,80.82 136.23,79.1 136.23,76.79 135.84,76.39 v136.03,76.2 | v113.22,52.25 112.95,52.25 112.95,50.38 110.36,47.79 110.36,47.32 arc-90 109.89,46.85 109.79,46.85 arc90 109.64,46.69 109.64,46.63 arc90 109.79,46.48 110.62,46.48 arc-90 111.09,46.01 111.09,45.95 arc-90 110.62,45.49 109.79,45.49 arc90 109.64,45.33 109.64,45.27 arc90 109.79,45.12 110.62,45.12 arc-90 111.09,44.65 111.09,44.59 arc-90 110.62,44.12 109.79,44.12 arc90 109.64,43.97 109.64,43.91 arc90 109.79,43.75 110.62,43.75 arc-90 111.09,43.29 111.09,43.23 arc-90 110.62,42.76 109.79,42.76 arc90 109.64,42.61 109.64,42.55 arc90 109.79,42.39 110.62,42.39 arc-90 111.09,41.92 111.09,41.86 arc-90 110.62,41.4 109.79,41.4 arc90 109.64,41.24 109.64,41.18 arc90 109.79,41.03 110.62,41.03 arc-90 111.09,40.56 111.09,40.5 arc-90 110.62,40.03 109.79,40.03 arc90 109.64,39.88 109.64,39.82 arc90 109.79,39.66 109.89,39.66 arc-90 110.36,39.2 110.36,32.7 110.05,32.39 110.05,27.27 110.53,26.79 110.95,26.79 111.41,26.33 111.41,25.53 111.52,25.43 ETH1.TD3-
  Bottom 0.121: v136.03,76.2 135.84,76.39 134.02,74.56 133.44,74.56 112.95,54.07 112.95,52.25 v113.22,52.25
ETH_TX3_P  (via drill 0.15)  (2 unrouted)